# Altium project D00173332_IP3734.PRJPCB
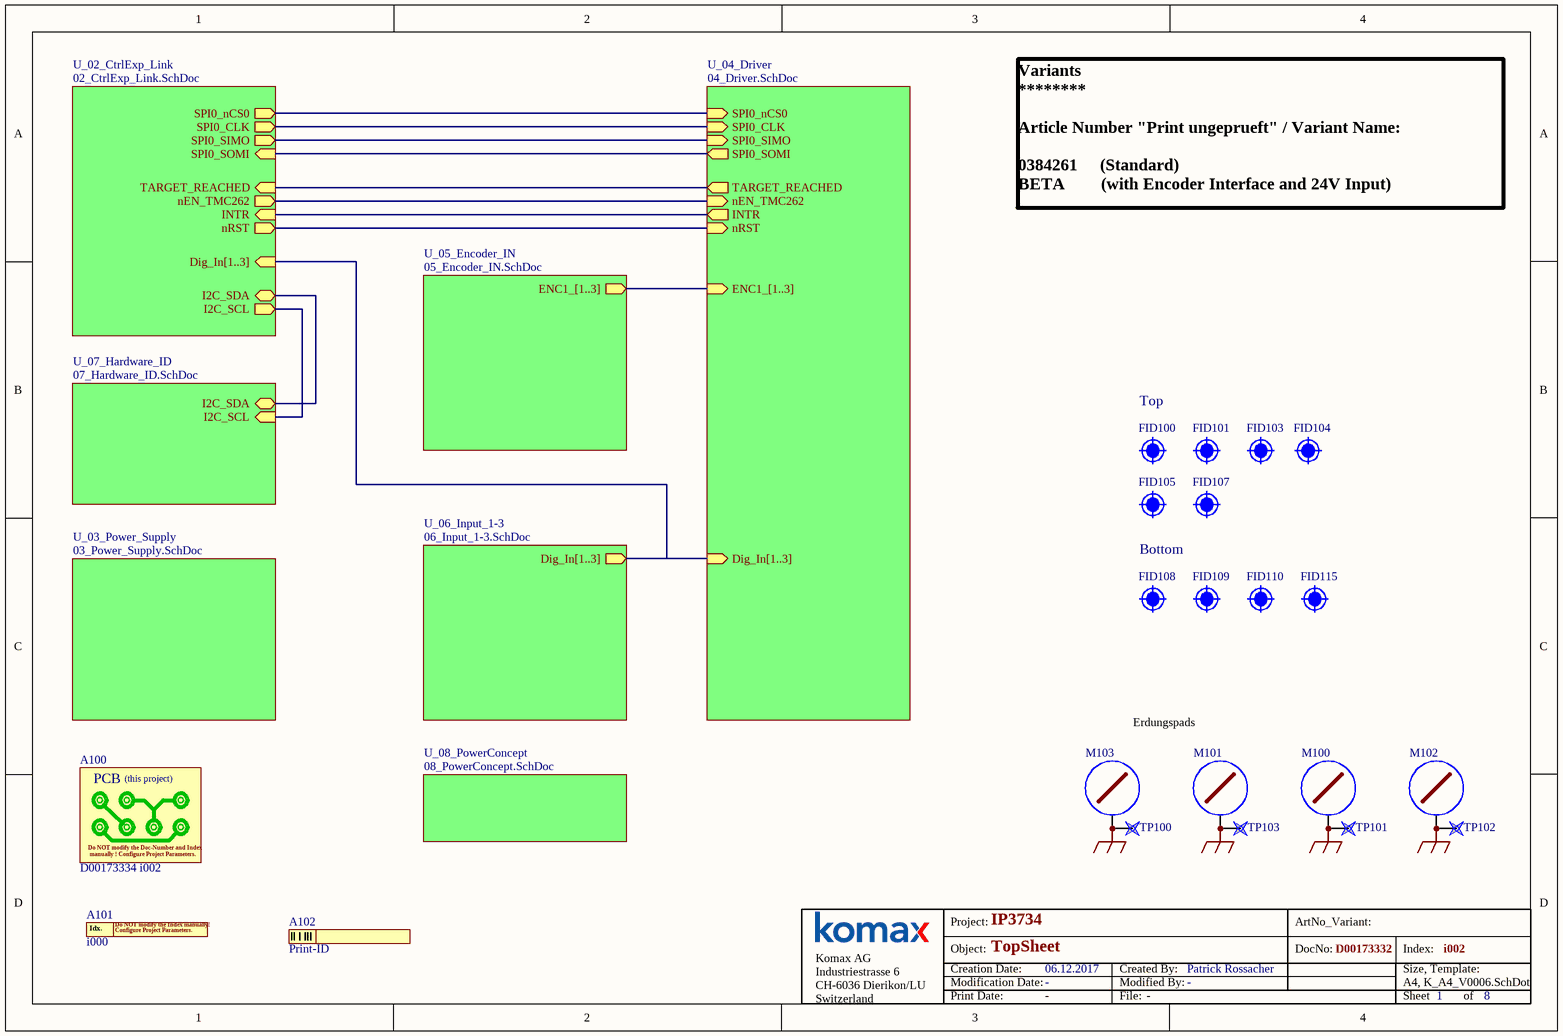
[diagram p0: 01_D00173332_TopSheet.SchDoc]
KPP_Assembly_DocNr: D00173333; KPP_Assembly_Variant_DocNr: Dyyyyyyyy; KPP_Idx: i002; KPP_Pcb_DocNr: D00173334; KPP_Pcb_Idx: i002; KPP_Proj_Name: IP3734; KPP_Proj_Sch_Bom_DocNr: D00173332; KPP_Proj_Vorlage: 0006 (do not edit); KSP_OutputFolder_AltiumProject: AltiumProject; KSP_OutputFolder_Assembly: AssemblyData; KSP_OutputFolder_Assembly_Variant: AssemblyDataVariant; KSP_OutputFolder_PCB: PCBData
8 sheets, 328 parts. Net scope: hierarchical (ports join the sheet entries above them; power ports are global).
Board file: D00173334_IP3734_pcb.pcbdoc
Sheets:
  01_D00173332_TopSheet.SchDoc
    U_02_CtrlExp_Link = 02_CtrlExp_Link.SchDoc
    U_03_Power_Supply = 03_Power_Supply.SchDoc
    U_04_Driver = 04_Driver.SchDoc
    U_05_Encoder_IN = 05_Encoder_IN.SchDoc
    U_06_Input_1-3 = 06_Input_1-3.SchDoc
    U_07_Hardware_ID = 07_Hardware_ID.SchDoc
    U_08_PowerConcept = 08_PowerConcept.SchDoc

## Sheet 01_D00173332_TopSheet.SchDoc: -
size A4; PageSetup: Record=PageOptions|CenterHorizontal=True|CenterVertical=True|PrintScale=0.97|XCorrection=1.00|YCorrection=1.00|PrintKind=1|BorderSize=5000000|LeftOffset=0|BottomOffset=0|Orientation=2|PaperLength=1000|PaperWidth=1000|Scale=100|PaperSource=7|PrintQuality=-4|MediaType=1|DitherType=10|PrintScaleMode=1|PaperKind=A4|PaperIndex=9; Date: -; ApprovedBy: -; CheckedBy: -; Author: -; CompanyName: -; DrawnBy: -; Engineer: -; Organization: Komax AG; Address1: -; Address2: -; Address3: -; Address4: -; DocumentNumber: -; Revision: -; SheetNumber: 1; SheetTotal: 8; KSDP_ObjectName: TopSheet; KSDP_CreationDate: 06.12.2017; KSDP_CreatedBy: Patrick Rossacher; KSDP_ModificationDate: -; KSDP_ModifiedBy: -; CurrentTime: -; CurrentDate: -; Time: -; DocumentFullPathAndName: -; DocumentName: -; ModifiedDate: -; ImagePath: -

### Parts
A100  D00173334 i002  (mechanical)
A101  i000  [PrintIndex]
A102  Print-ID  [PrintID]
FID100  Fiducial  [FID_1.1mm]  (value not drawn)  (no BOM)
FID101  Fiducial  [FID_1.1mm]  (value not drawn)  (no BOM)
FID103  Fiducial  [FID_1.1mm]  (value not drawn)  (no BOM)
FID104  Fiducial  [FID_1.1mm]  (value not drawn)  (no BOM)
FID105  Fiducial  [FID_1.1mm]  (value not drawn)  (no BOM)
FID107  Fiducial  [FID_1.1mm]  (value not drawn)  (no BOM)
FID108  Fiducial  [FID_1.1mm]  (value not drawn)  (no BOM)
FID109  Fiducial  [FID_1.1mm]  (value not drawn)  (no BOM)
FID110  Fiducial  [FID_1.1mm]  (value not drawn)  (no BOM)
FID115  Fiducial  [FID_1.1mm]  (value not drawn)  (no BOM)
M100  M4  [M4/4,5/PAD9]  (value not drawn)  (no BOM)
M101  M4  [M4/4,5/PAD9]  (value not drawn)  (no BOM)
M102  M4  [M4/4,5/PAD9]  (value not drawn)  (no BOM)
M103  M4  [M4/4,5/PAD9]  (value not drawn)  (no BOM)
TP100  Testpoint  [TP1.5MM]  (value not drawn)  (no BOM)
TP101  Testpoint  [TP1.5MM]  (value not drawn)  (no BOM)
TP102  Testpoint  [TP1.5MM]  (value not drawn)  (no BOM)
TP103  Testpoint  [TP1.5MM]  (value not drawn)  (no BOM)

### Sub-sheets
U_02_CtrlExp_Link = 02_CtrlExp_Link.SchDoc: I2C_SDA (bidir), I2C_SCL (out), SPI0_nCS0 (out), SPI0_CLK (out), SPI0_SIMO (out), SPI0_SOMI (in), nEN_TMC262 (out), TARGET_REACHED (in), INTR (in), nRST (out), Dig_In[1..3] (in)
U_03_Power_Supply = 03_Power_Supply.SchDoc: no entries
U_04_Driver = 04_Driver.SchDoc: Dig_In[1..3] (in), ENC1_[1..3] (in), SPI0_nCS0 (in), SPI0_CLK (in), SPI0_SIMO (in), SPI0_SOMI (out), nEN_TMC262 (in), TARGET_REACHED (out), INTR (out), nRST (in)
U_05_Encoder_IN = 05_Encoder_IN.SchDoc: ENC1_[1..3] (out)
U_06_Input_1-3 = 06_Input_1-3.SchDoc: Dig_In[1..3] (out)
U_07_Hardware_ID = 07_Hardware_ID.SchDoc: I2C_SDA (bidir), I2C_SCL (in)
U_08_PowerConcept = 08_PowerConcept.SchDoc: no entries

### Nets
SHIELD_1: M103.1 TP100.1
SHIELD_2: M101.1 TP103.1
SHIELD_3: M100.1 TP101.1
SHIELD_4: M102.1 TP102.1
I2C_SCL: sheet U_02_CtrlExp_Link/I2C_SCL, sheet U_07_Hardware_ID/I2C_SCL
I2C_SDA: sheet U_02_CtrlExp_Link/I2C_SDA, sheet U_07_Hardware_ID/I2C_SDA
INTR: sheet U_02_CtrlExp_Link/INTR, sheet U_04_Driver/INTR
nRST: sheet U_02_CtrlExp_Link/nRST, sheet U_04_Driver/nRST
SPI0_CLK: sheet U_02_CtrlExp_Link/SPI0_CLK, sheet U_04_Driver/SPI0_CLK
SPI0_nCS0: sheet U_02_CtrlExp_Link/SPI0_nCS0, sheet U_04_Driver/SPI0_nCS0
SPI0_SIMO: sheet U_02_CtrlExp_Link/SPI0_SIMO, sheet U_04_Driver/SPI0_SIMO
SPI0_SOMI: sheet U_02_CtrlExp_Link/SPI0_SOMI, sheet U_04_Driver/SPI0_SOMI
TARGET_REACHED: sheet U_02_CtrlExp_Link/TARGET_REACHED, sheet U_04_Driver/TARGET_REACHED
NetR401_1: sheet U_02_CtrlExp_Link/nEN_TMC262, sheet U_04_Driver/nEN_TMC262

### Buses and harness runs
bus sheet U_02_CtrlExp_Link/Dig_In[1..3] = sheet U_04_Driver/Dig_In[1..3] = sheet U_06_Input_1-3/Dig_In[1..3]
bus sheet U_04_Driver/ENC1_[1..3] = sheet U_05_Encoder_IN/ENC1_[1..3]

### Notes on the sheet
- Variants
  ********
  Article Number "Print ungeprueft" / Variant Name:
  0384261     (Standard)
  BETA        (with Encoder Interface and 24V Input)
- Top
- Bottom
- Erdungspads
- Project:
- ArtNo_Variant:
- Object:
- Creation Date:
- Modification Date:
- Created By:
- Modified By:
- DocNo:
- Index:
- Size, Template:
- A4, K_A4_V0006.SchDot
- Komax AG
  Industriestrasse 6
  CH-6036 Dierikon/LU
  Switzerland
- Print Date:
- File:
- Sheet
- of
- (in symbol Kleber Artikel-Index) Do NOT modify the Index manually!; Idx.; Configure Project Parameters.
- (in symbol PCB from project) PCB; (this project); Do NOT modify the Doc-Number and Index; manually ! Configure Project Parameters.

### Library data of the parts
A100 = PCB from project: PCB not assembled
A101 = Kleber Artikel-Index: Etiquette Article-Index; Notes: Positioning and design see assembly instructions
A102 = Kleber Printidentifikation: Etiquette PCB Identification; Notes: Positioning and design see assembly instructions
FID100 FID101 FID103-FID105 FID107-FID110 FID115 = FID: FootprintBOM: Fiducal 1.1mm; Notes: Fiducial
M100-M103 = PAD1: Bohrung mit PAD; Strategic: 0; Bezeichnung: M4
TP100-TP103 = P_PRUEFPAD: FootprintBOM: Testpoint

## Sheet 02_CtrlExp_Link.SchDoc: -
size A4; Date: -; ApprovedBy: -; CheckedBy: -; Author: -; CompanyName: -; DrawnBy: -; Engineer: -; Organization: Komax AG; Address1: -; Address2: -; Address3: -; Address4: -; DocumentNumber: -; Revision: -; SheetNumber: 2; SheetTotal: 8; KSDP_ObjectName: CtrlExp Link; KSDP_CreatedBy: Patrick Rossacher; KSDP_CreationDate: 20.12.2017; KSDP_ModificationDate: -; KSDP_ModifiedBy: -; CurrentTime: -; CurrentDate: -; Time: -; DocumentFullPathAndName: -; DocumentName: -; ModifiedDate: -; ImagePath: -
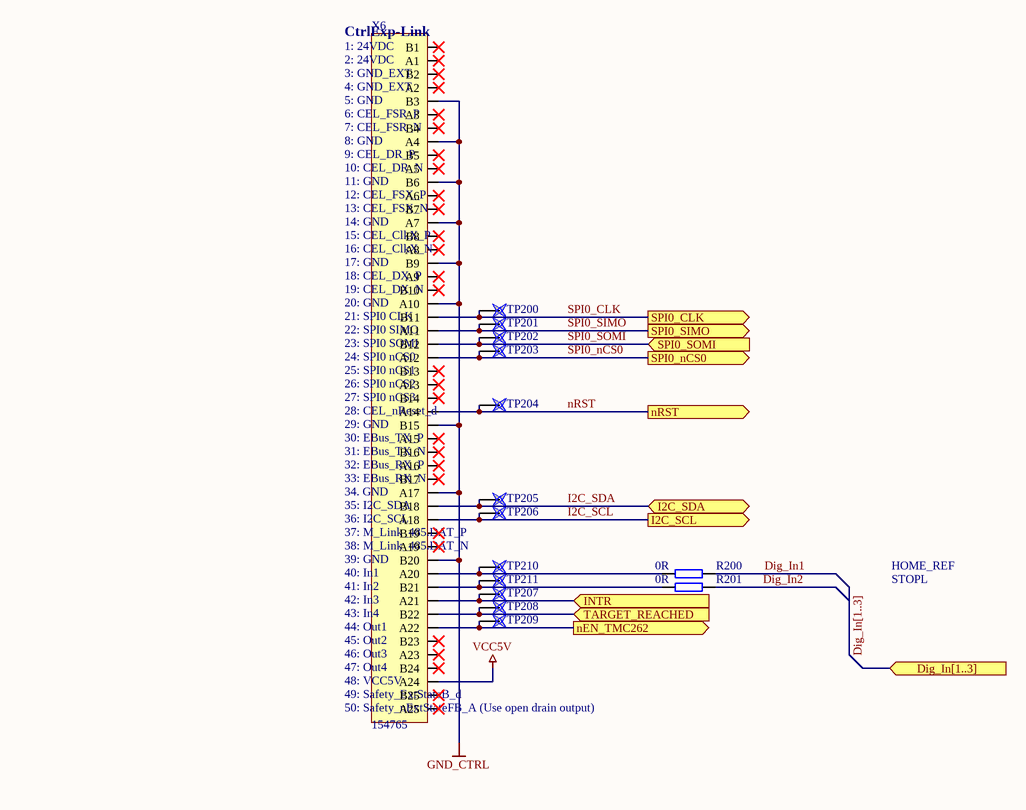
[diagram p1: 02_CtrlExp_Link.SchDoc]

### Parts
(Parts that share a designator on the sheet are numbered #1, #2 ... from top to bottom, then left to right.)
R200  0R  [0402_R]
R201  0R  [0402_R]
TP200  Testpoint  [TP1.5MM]  (value not drawn)  (no BOM)
TP201  Testpoint  [TP1.5MM]  (value not drawn)  (no BOM)
TP202  Testpoint  [TP1.5MM]  (value not drawn)  (no BOM)
TP203  Testpoint  [TP1.5MM]  (value not drawn)  (no BOM)
TP204  Testpoint  [TP1.5MM]  (value not drawn)  (no BOM)
TP205  Testpoint  [TP1.5MM]  (value not drawn)  (no BOM)
TP206  Testpoint  [TP1.5MM]  (value not drawn)  (no BOM)
TP207  Testpoint  [TP1.5MM]  (value not drawn)  (no BOM)
TP208  Testpoint  [TP1.5MM]  (value not drawn)  (no BOM)
TP209  Testpoint  [TP1.5MM]  (value not drawn)  (no BOM)
TP210  Testpoint  [TP1.5MM]  (value not drawn)  (no BOM)
TP211  Testpoint  [TP1.5MM]  (value not drawn)  (no BOM)
X6#1  154765  [CON_SMD_50P_ERNI_154765]

### Ports
Dig_In[1..3] (in), I2C_SCL (out), I2C_SDA (bidir), INTR (in), nEN_TMC262 (out), nRST (out), SPI0_CLK (out), SPI0_nCS0 (out), SPI0_SIMO (out), SPI0_SOMI (in), TARGET_REACHED (in)

### Nets
GND_CTRL: X6#1.A4 X6#1.A7 X6#1.A10 X6#1.A17 X6#1.B3 X6#1.B6 X6#1.B9 X6#1.B15 X6#1.B20
VCC5V: X6#1.A24
Dig_In1: R200.2
Dig_In2: R201.2
I2C_SCL: TP206.1 X6#1.A18 ; port I2C_SCL
I2C_SDA: TP205.1 X6#1.B18 ; port I2C_SDA
INTR: TP207.1 X6#1.A21 ; port INTR
nRST: TP204.1 X6#1.A14 ; port nRST
SPI0_CLK: TP200.1 X6#1.B11 ; port SPI0_CLK
SPI0_nCS0: TP203.1 X6#1.A12 ; port SPI0_nCS0
SPI0_SIMO: TP201.1 X6#1.A11 ; port SPI0_SIMO
SPI0_SOMI: TP202.1 X6#1.B12 ; port SPI0_SOMI
TARGET_REACHED: TP208.1 X6#1.B22 ; port TARGET_REACHED
NetR200_1: R200.1 TP210.1 X6#1.A20
NetR201_1: R201.1 TP211.1 X6#1.B21
NetR401_1: TP209.1 X6#1.A22 ; port nEN_TMC262

Not connected (* = marked no-connect by the designer): X6#1 A1* A2* A3* A5* A6* A8* A9* A13* A15* A16* A19* A23* A25* B1* B2* B4* B5* B7* B8* B10* B13* B14* B16* B17* B19* B23* B24* B25*

### Buses and harness runs
bus Dig_In[1..3] = port Dig_In[1..3]

### Notes on the sheet
- CtrlExp-Link
- 5: GND
- 1: 24VDC
- 2: 24VDC
- 6: CEL_FSR_P
- 3: GND_EXT
- 4: GND_EXT
- 7: CEL_FSR_N
- 8: GND
- 9: CEL_DR_P
- 10: CEL_DR_N
- 11: GND
- 12: CEL_FSX_P
- 13: CEL_FSX_N
- 14: GND
- 15: CEL_ClkX_P
- 16: CEL_ClkX_N
- 17: GND
- 18: CEL_DX_P
- 19: CEL_DX_N
- 20: GND
- 21: SPI0 CLK
- 22: SPI0 SIMO
- 23: SPI0 SOMI
- 24: SPI0 nCS0
- 25: SPI0 nCS1
- 26: SPI0 nCS2
- 27: SPI0 nCS3
- 29: GND
- 30: EBus_TX_P
- 28: CEL_nReset_d
- 34. GND
- 31: EBus_TX_N
- 32: EBus_RX_P
- 33: EBus_RX_N
- 35: I2C_SDA
- 36: I2C_SCL
- 39: GND
- 37: M_Link_485.DAT_P
- 40: In1
- 38: M_Link_485.DAT_N
- STOPL
- HOME_REF
- 41: In2
- 42: In3
- 43: In4
- 44: Out1
- 45: Out2
- 46: Out3
- 48: VCC5V
- 49: Safety_ExtStateB_d
- 50: Safety_nExtStateFB_A (Use open drain output)
- 47: Out4
- Project:
- ArtNo_Variant:
- Object:
- Creation Date:
- Modification Date:
- Created By:
- Modified By:
- DocNo:
- Index:
- Size, Template:
- A4, K_A4_V0006.SchDot
- Komax AG
  Industriestrasse 6
  CH-6036 Dierikon/LU
  Switzerland
- Print Date:
- File:
- Sheet
- of

### Library data of the parts
R200 R201 = RES2: Resistor 0.063W 1%; FootprintBOM: 0402
TP200-TP211 = P_PRUEFPAD: FootprintBOM: Testpoint
X6#1 = CON_50P_ERNI: Connector SMC 2x25p 90° 1.27mm; Manufacturer: ERNI; MaxTemp: 125; MinTemp: -55; 2ndSource: 15 15 050 5601 333 / Harting; 3rdSource: *; Bemerkung: 90°; Distributor: *; FootprintBOM: SMD RM=1.27mm; Notes: *; Reference: *; Strategic: *

## Sheet 03_Power_Supply.SchDoc: -
size A4; Date: -; ApprovedBy: -; CheckedBy: -; Author: -; CompanyName: -; DrawnBy: -; Engineer: -; Organization: Komax AG; Address1: -; Address2: -; Address3: -; Address4: -; DocumentNumber: -; Revision: -; SheetNumber: 3; SheetTotal: 8; KSDP_ObjectName: Power Supply; KSDP_CreatedBy: Patrick Rossacher; KSDP_CreationDate: 15.12.2017; KSDP_ModificationDate: -; KSDP_ModifiedBy: -; CurrentTime: -; CurrentDate: -; Time: -; DocumentFullPathAndName: -; DocumentName: -; ModifiedDate: -; ImagePath: -
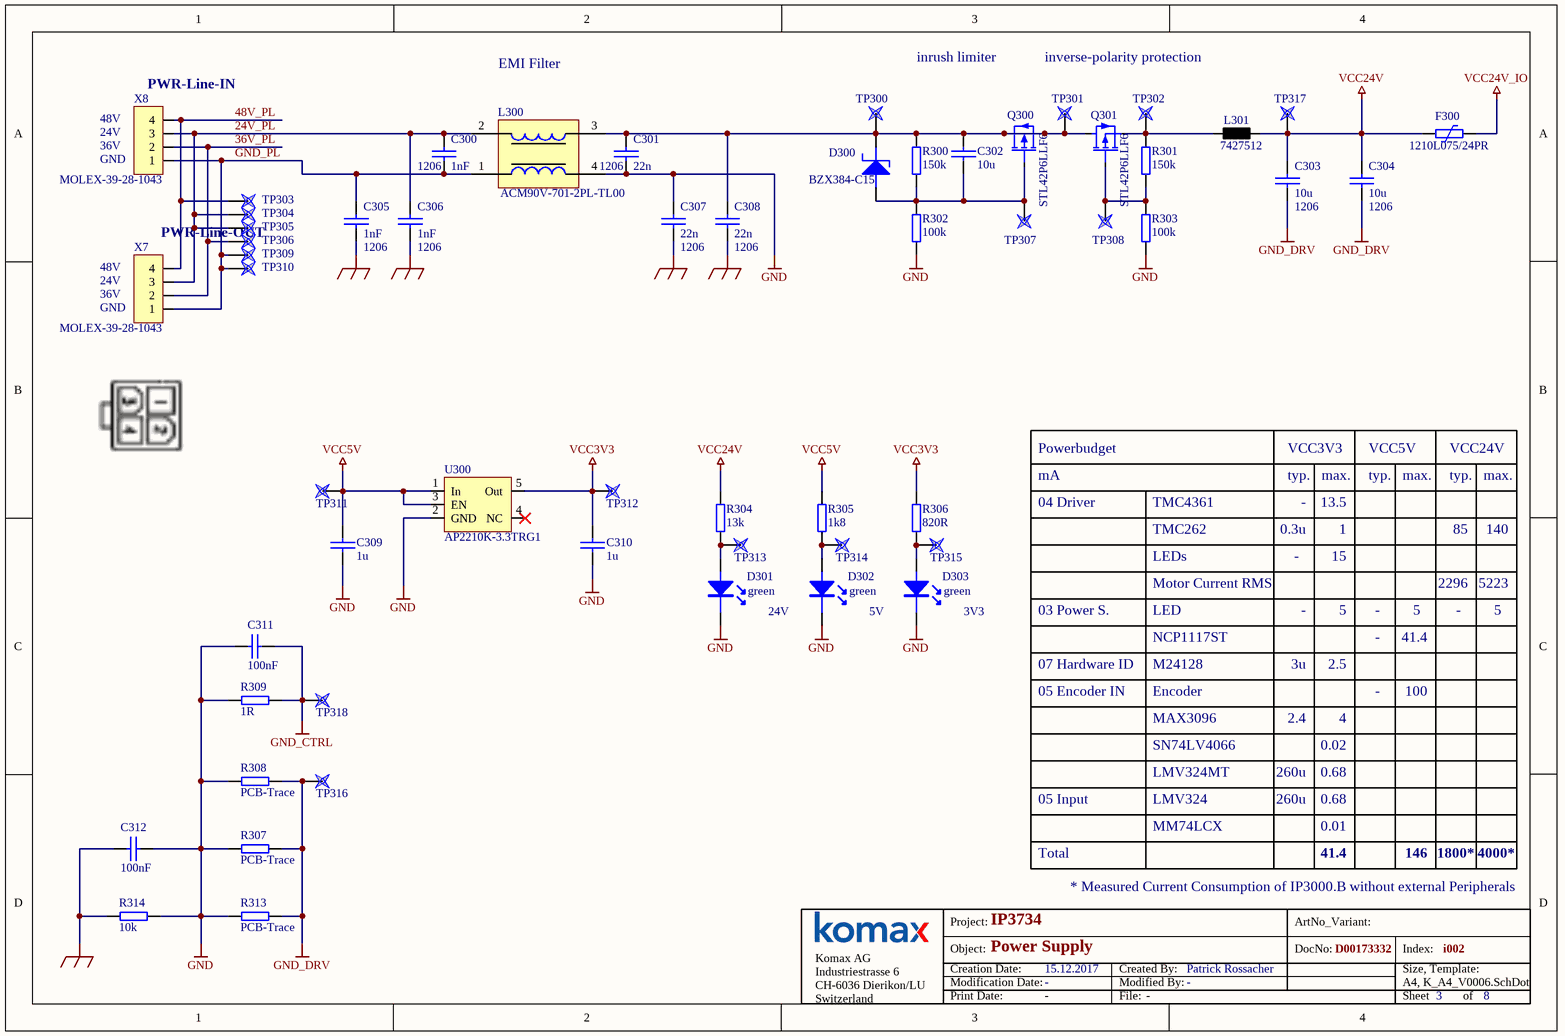
[diagram p2: 03_Power_Supply.SchDoc]

### Parts
(Parts that share a designator on the sheet are numbered #1, #2 ... from top to bottom, then left to right.)
C300  1nF  FootprintBOM: 1206  [1206_C]
C301  22n  FootprintBOM: 1206  [1206_C]
C302  10u  [1206_C]
C303  10u  FootprintBOM: 1206  [1206_C]
C304  10u  FootprintBOM: 1206  [1206_C]
C305  1nF  FootprintBOM: 1206  [1206_C]
C306  1nF  FootprintBOM: 1206  [1206_C]
C307  22n  FootprintBOM: 1206  [1206_C]
C308  22n  FootprintBOM: 1206  [1206_C]
C309  1u  [0805_C]
C310  1u  [0805_C]
C311  100nF  [0805_C]
C312  100nF  [0805_C]
D300  BZX384-C15  [SOD-323]
D301  color: green  [0603_led]  (hidden comment: HSMG-C190)
D302  color: green  [0603_led]  (hidden comment: HSMG-C190)
D303  color: green  [0603_led]  (hidden comment: HSMG-C190)
F300  1210L075/24PR  [1210_L]
L300  ACM90V-701-2PL-TL00  [ACM90V]
L301  7427512  [7427512]
Q300  STL42P6LLF6  [PQFN-8_Multi]
Q301  STL42P6LLF6  [PQFN-8_Multi]
R300  150k  [0402_R]
R301  150k  [0402_R]
R302  100k  [0402_R]
R303  100k  [0402_R]
R304  13k  [1206_R]
R305  1k8  [0402_R]
R306  820R  [0402_R]
R307  PCB-Trace  [NET-CONNECT6]  (net tie, no BOM)
R308  PCB-Trace  [NET-CONNECT6]  (net tie, no BOM)
R309  1R  [0805_R]
R313  PCB-Trace  [NET-CONNECT6]  (net tie, no BOM)
R314  10k  [0805_R]
TP300  Testpoint  [TP1.5MM]  (value not drawn)  (no BOM)
TP301  Testpoint  [TP1.5MM]  (value not drawn)  (no BOM)
TP302  Testpoint  [TP1.5MM]  (value not drawn)  (no BOM)
TP303  Testpoint  [TP1.5MM]  (value not drawn)  (no BOM)
TP304  Testpoint  [TP1.5MM]  (value not drawn)  (no BOM)
TP305  Testpoint  [TP1.5MM]  (value not drawn)  (no BOM)
TP306  Testpoint  [TP1.5MM]  (value not drawn)  (no BOM)
TP307  Testpoint  [TP1.5MM]  (value not drawn)  (no BOM)
TP308  Testpoint  [TP1.5MM]  (value not drawn)  (no BOM)
TP309  Testpoint  [TP1.5MM]  (value not drawn)  (no BOM)
TP310  Testpoint  [TP1.5MM]  (value not drawn)  (no BOM)
TP311  Testpoint  [TP1.5MM]  (value not drawn)  (no BOM)
TP312  Testpoint  [TP1.5MM]  (value not drawn)  (no BOM)
TP313  Testpoint  [TP1.5MM]  (value not drawn)  (no BOM)
TP314  Testpoint  [TP1.5MM]  (value not drawn)  (no BOM)
TP315  Testpoint  [TP1.5MM]  (value not drawn)  (no BOM)
TP316  Testpoint  [TP1.5MM]  (value not drawn)  (no BOM)
TP317  Testpoint  [TP1.5MM]  (value not drawn)  (no BOM)
TP318  Testpoint  [TP1.5MM]  (value not drawn)  (no BOM)
U300  AP2210K-3.3TRG1  [SOT23-5]
X7#1  MOLEX-39-28-1043  [MOLEX-Minifit_4P_90_180deg]
X8#1  MOLEX-39-28-1043  [MOLEX-Minifit_4P_90_180deg]

### Nets
GND: C301.1 C307.2 C309.2 C310.2 C311.2 C312.1 D301.K D302.K D303.K L300.4 R302.1 R303.1 R307.2 R308.2 R309.2 R313.2 R314.1 U300.2(GND)
GND_CTRL: C311.1 R309.1 TP318.1
GND_DRV: C303.1 C304.1 R307.1 R308.1 R313.1 TP316.1
SHIELD_3: C305.1 C306.1 C307.1 C308.1 C312.2 R314.2
VCC3V3: C310.1 R306.2 TP312.1 U300.5(Out)
VCC5V: C309.1 R305.2 TP311.1 U300.1(In) U300.3(EN)
VCC24V: C303.2 C304.2 F300.1 L301.2 R304.2 TP317.1
VCC24V_IO: F300.2
24V_PL: C300.2 C306.2 L300.2 TP304.1 TP305.1 X7#1.3 X8#1.3
36V_PL: TP306.1 X7#1.2 X8#1.2
48V_PL: TP303.1 X7#1.4 X8#1.4
GND_PL: C300.1 C305.2 L300.1 TP309.1 TP310.1 X7#1.1 X8#1.1
NetC301_2: C301.2 C302.1 C308.2 D300.K L300.3 Q300.D Q300.S Q301.D R300.2 TP300.1 TP301.1
NetC302_2: C302.2 D300.A Q300.G R300.1 R302.2 TP307.1
NetD301_A: D301.A R304.1 TP313.1
NetD302_A: D302.A R305.1 TP314.1
NetD303_A: D303.A R306.1 TP315.1
NetL301_1: L301.1 Q301.S R301.2 TP302.1
NetQ301_G: Q301.G R301.1 R303.2 TP308.1

Not connected (* = marked no-connect by the designer): U300 4(NC)*

### Notes on the sheet
- (near X8#1) PWR-Line-IN
- EMI Filter
- inrush limiter
- inverse-polarity protection
- (near X8#1) GND
- (near X8#1) 36V
- (near X8#1) 24V
- (near X8#1) 48V
- (near X7#1) PWR-Line-OUT
- (near X7#1) GND
- (near X7#1) 36V
- (near X7#1) 24V
- (near X7#1) 48V
- Powerbudget
- 04 Driver
- mA
- TMC4361
- VCC3V3
- typ.
- -
- max.
- 13.5
- VCC5V
- VCC24V
- TMC262
- LEDs
- 0.3u
- 1
- 15
- 85
- 140
- (near D301) 24V
- 5V
- (near D303) 3V3
- 03 Power S.
- Motor Current RMS
- NCP1117ST
- LED
- 5
- 41.4
- 2296
- 5223
- 07 Hardware ID
- 05 Encoder IN
- M24128
- Encoder
- 3u
- 2.5
- 100
- MAX3096
- SN74LV4066
- LMV324MT
- 2.4
- 260u
- 4
- 0.02
- 0.68
- 05 Input
- MM74LCX
- LMV324
- 0.01
- Total
- 146
- 1800*
- 4000*
- * Measured Current Consumption of IP3000.B without external Peripherals
- Project:
- ArtNo_Variant:
- Object:
- Creation Date:
- Modification Date:
- Created By:
- Modified By:
- DocNo:
- Index:
- Size, Template:
- A4, K_A4_V0006.SchDot
- Komax AG
  Industriestrasse 6
  CH-6036 Dierikon/LU
  Switzerland
- Print Date:
- File:
- Sheet
- of

### Library data of the parts
C300-C308 = CAP: Ceramic Capacitor >=50V X7R
  C302: FootprintBOM: 1206
C309 C310 = CAP: Ceramic Capacitor >=25V; FootprintBOM: 0805
C311 C312 = Cap: Ceramic Capacitor >=50V X7R; FootprintBOM: 0805
D300 = DIODEZENER: ZenerDiode 15V; Manufacturer: NXP; MaxTemp: Tj +150; MinTemp: -55; FootprintBOM: SOD-323
D301-D303 = LED: SMD LED green; Manufacturer: AVAGO; Forward Voltage: 2.2V
F300 = THERMAL FUSE_1: Polyfuse 750mA; Manufacturer: Littlefuse; MaxTemp: +85; MinTemp: -40; FootprintBOM: 1210
L300 = ACM1211-701-2PL-TL01: Common Mode Chokes Dual 700Ohm 100MHz 5A 10mOhm DCR SMD T/R; Manufacturer: TDK; FootprintBOM: ACM90V
L301 = Power_Choke: Ferrit Bead 580Ohm @ 100MHz / 5A; Manufacturer: Würth
Q300 Q301 = MOSFET-P 1G,2x,3S,4D (Diode): P-Channel Power MOSFET, -60V; 3rdSource: FDMS86163P; MaxTemp: 175; MinTemp: -50; Rdson: 26m; 2ndSourcesReleased: DMP6050SPS-13; Bemerkung: *; Distributor: *; FootprintBOM: *; Manufacturer: *; Notes: *; Reference: *; Strategic: *
R300-R303 R305 R306 = RES2: Resistor 0.063W 1%; FootprintBOM: 0402
R304 = RES2: Resistor 0.25W 1%; FootprintBOM: 1206
R307 R308 R313 = RES2: Circuit Path; FootprintBOM: -
R309 R314 = RES2: Resistor 0.125W 1%; FootprintBOM: 0805
TP300-TP318 = P_PRUEFPAD: FootprintBOM: Testpoint
U300 = Linear_Regulator: Linear Voltage Regulator; Manufacturer: Diodes Incorporated; 3rdSource: SPX3819M5-L-3-3/TR; 2ndSourcesReleased: LD2980CM33TR; FootprintBOM: SOT-23-5
X7#1 X8#1 = CON_4P: Connector Mini Fit 4p 180°; Manufacturer: Molex; FootprintBOM: THT

## Sheet 04_Driver.SchDoc: -
size A3; Date: -; ApprovedBy: -; CheckedBy: -; Author: -; CompanyName: -; DrawnBy: -; Engineer: -; Organization: Komax AG; Address1: -; Address2: -; Address3: -; Address4: -; DocumentNumber: -; Revision: -; SheetNumber: 4; SheetTotal: 8; KSDP_ObjectName: Driver; KSDP_CreatedBy: Patrick Rossacher; KSDP_CreationDate: 15.12.2017; KSDP_ModificationDate: -; KSDP_ModifiedBy: -; CurrentTime: -; CurrentDate: -; Time: -; DocumentFullPathAndName: -; DocumentName: -; ModifiedDate: -; ImagePath: -
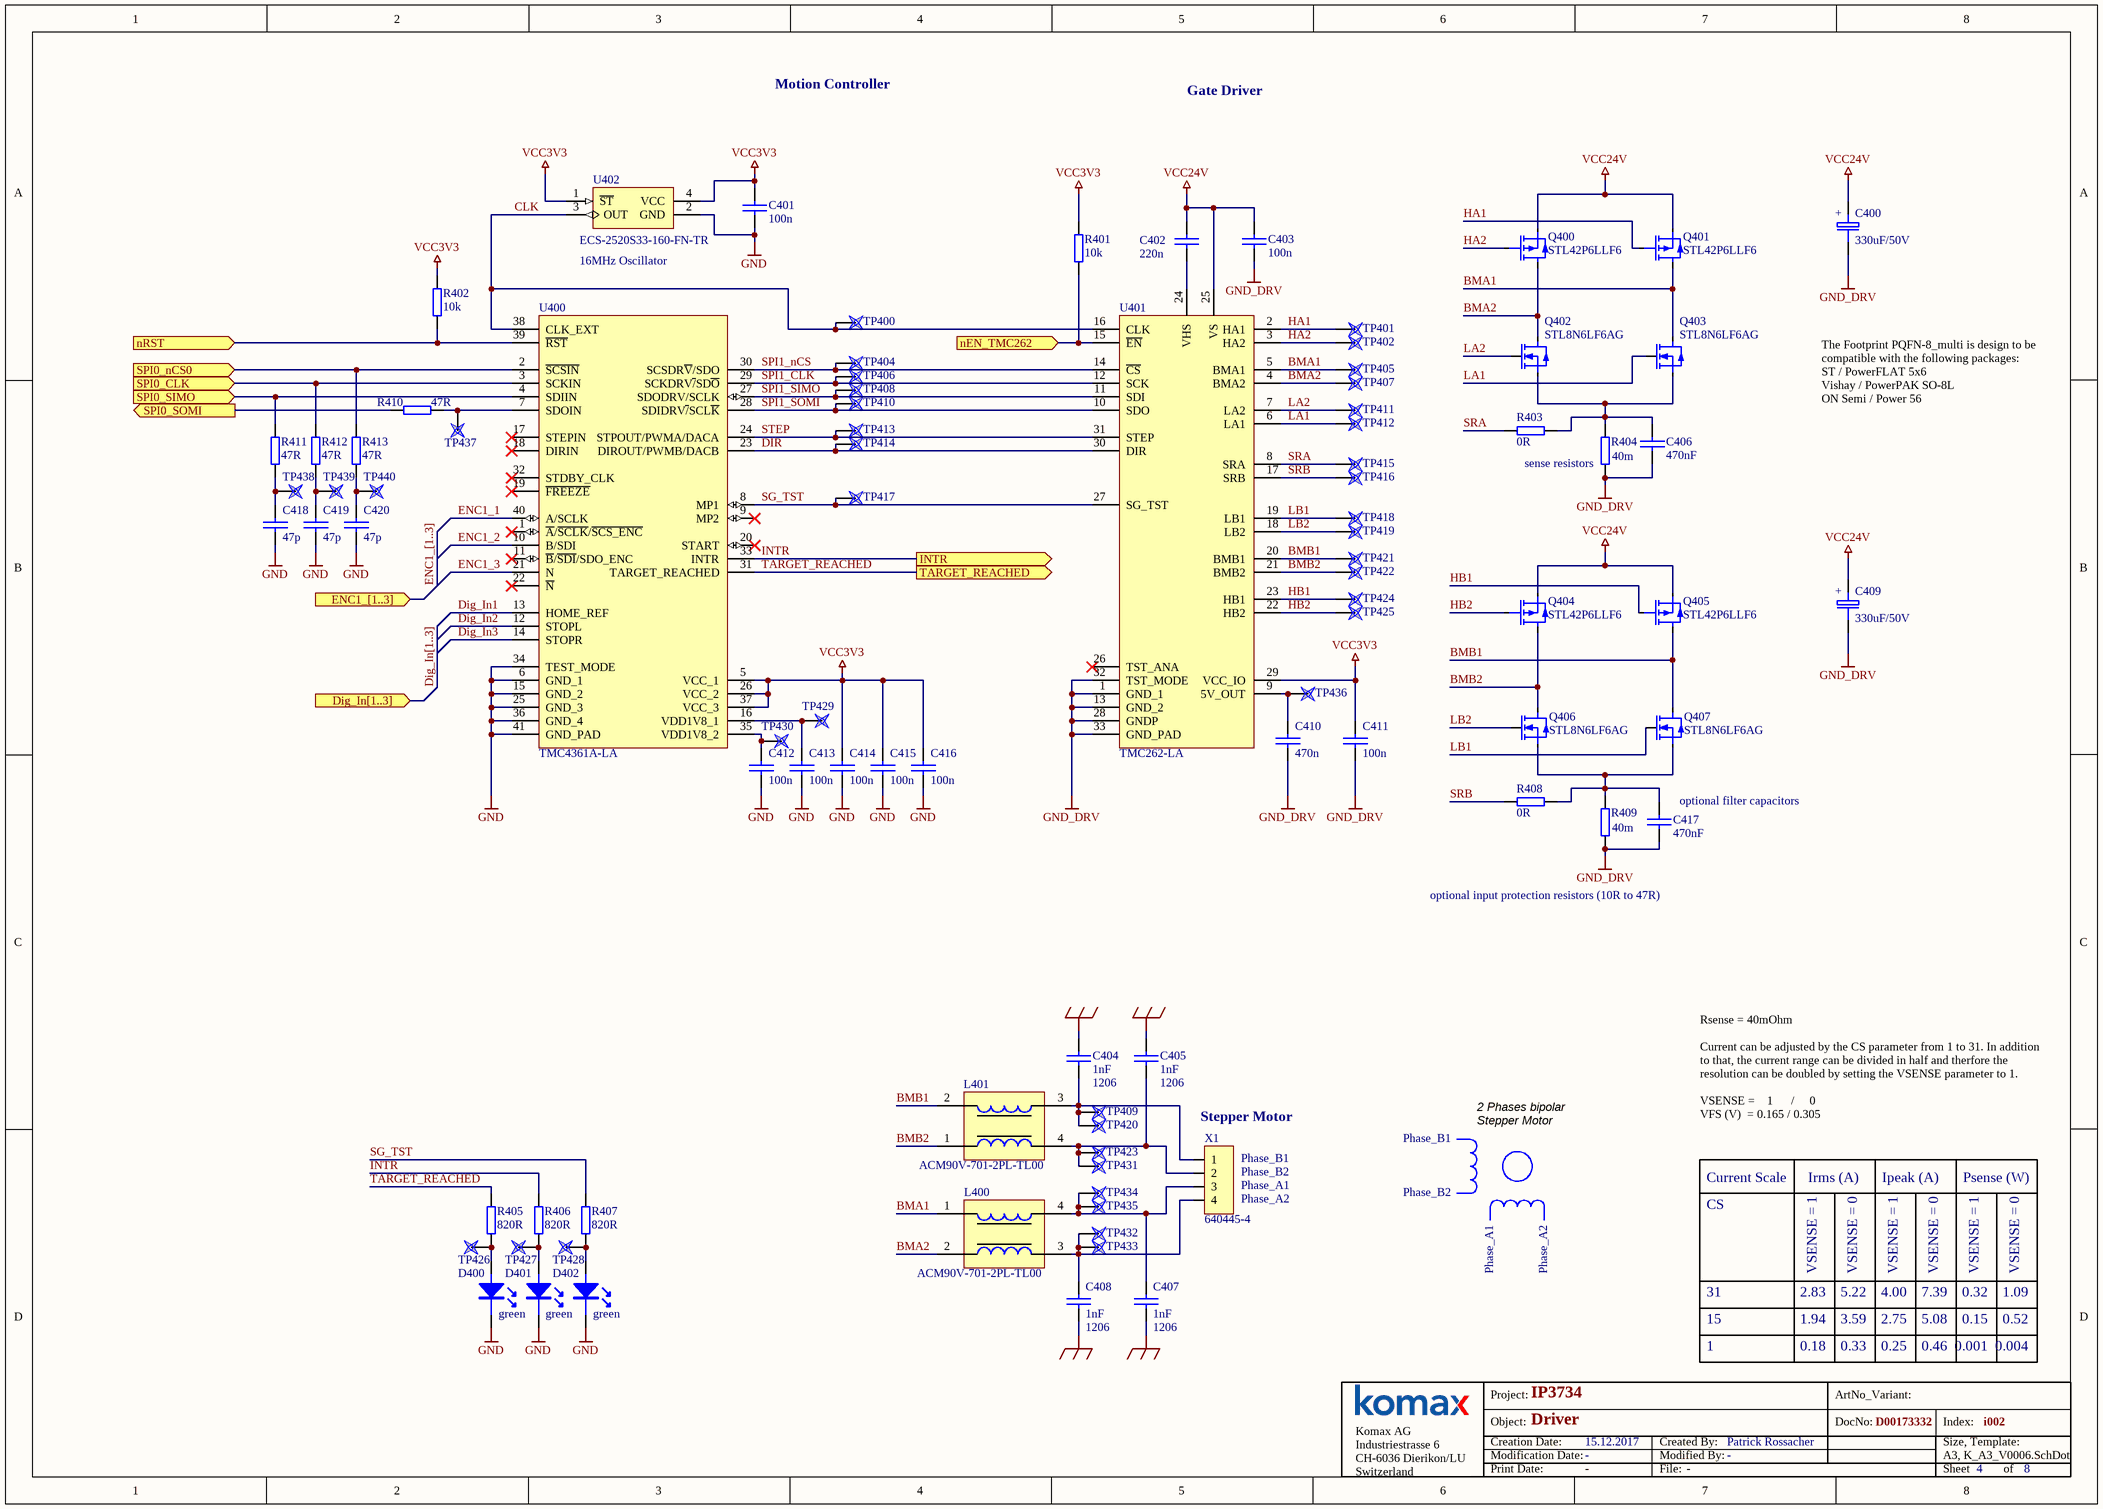
[diagram p3: 04_Driver.SchDoc]

### Parts
(Parts that share a designator on the sheet are numbered #1, #2 ... from top to bottom, then left to right.)
C400  330uF/50V  [SMD_Cap_Panasonic_H13]
C401  100n  [0402_C]
C402  220n  [0603_C]
C403  100n  [0402_C]
C404  1nF  FootprintBOM: 1206  [1206_C]
C405  1nF  FootprintBOM: 1206  [1206_C]
C406  470nF  [0603_C]
C407  1nF  FootprintBOM: 1206  [1206_C]
C408  1nF  FootprintBOM: 1206  [1206_C]
C409  330uF/50V  [SMD_Cap_Panasonic_H13]
C410  470n  [0603_C]
C411  100n  [0402_C]
C412  100n  [0402_C]
C413  100n  [0402_C]
C414  100n  [0402_C]
C415  100n  [0402_C]
C416  100n  [0402_C]
C417  470nF  [0603_C]
C418  47p  [0402_C]
C419  47p  [0402_C]
C420  47p  [0402_C]
D400  color: green  [0603_led]  (hidden comment: HSMG-C190)
D401  color: green  [0603_led]  (hidden comment: HSMG-C190)
D402  color: green  [0603_led]  (hidden comment: HSMG-C190)
L400  ACM90V-701-2PL-TL00  [ACM90V]
L401  ACM90V-701-2PL-TL00  [ACM90V]
Q400  STL42P6LLF6  [PQFN-8_Multi]
Q401  STL42P6LLF6  [PQFN-8_Multi]
Q402  STL8N6LF6AG  [PQFN-8_Multi]
Q403  STL8N6LF6AG  [PQFN-8_Multi]
Q404  STL42P6LLF6  [PQFN-8_Multi]
Q405  STL42P6LLF6  [PQFN-8_Multi]
Q406  STL8N6LF6AG  [PQFN-8_Multi]
Q407  STL8N6LF6AG  [PQFN-8_Multi]
R401  10k  [0402_R]
R402  10k  [0402_R]
R403  0R  [0402_R]
R404  value 40m  [2512_R]  (hidden comment: CRA2512-FZ-R040ELF)
R405  820R  [0402_R]
R406  820R  [0402_R]
R407  820R  [0402_R]
R408  0R  [0402_R]
R409  value 40m  [2512_R]  (hidden comment: CRA2512-FZ-R040ELF)
R410  47R  [0402_R]
R411  47R  [0402_R]
R412  47R  [0402_R]
R413  47R  [0402_R]
TP400  Testpoint  [TP1.5MM]  (value not drawn)  (no BOM)
TP401  Testpoint  [TP1.5MM]  (value not drawn)  (no BOM)
TP402  Testpoint  [TP1.5MM]  (value not drawn)  (no BOM)
TP404  Testpoint  [TP1.5MM]  (value not drawn)  (no BOM)
TP405  Testpoint  [TP1.5MM]  (value not drawn)  (no BOM)
TP406  Testpoint  [TP1.5MM]  (value not drawn)  (no BOM)
TP407  Testpoint  [TP1.5MM]  (value not drawn)  (no BOM)
TP408  Testpoint  [TP1.5MM]  (value not drawn)  (no BOM)
TP409  Testpoint  [TP1.5MM]  (value not drawn)  (no BOM)
TP410  Testpoint  [TP1.5MM]  (value not drawn)  (no BOM)
TP411  Testpoint  [TP1.5MM]  (value not drawn)  (no BOM)
TP412  Testpoint  [TP1.5MM]  (value not drawn)  (no BOM)
TP413  Testpoint  [TP1.5MM]  (value not drawn)  (no BOM)
TP414  Testpoint  [TP1.5MM]  (value not drawn)  (no BOM)
TP415  Testpoint  [TP1.5MM]  (value not drawn)  (no BOM)
TP416  Testpoint  [TP1.5MM]  (value not drawn)  (no BOM)
TP417  Testpoint  [TP1.5MM]  (value not drawn)  (no BOM)
TP418  Testpoint  [TP1.5MM]  (value not drawn)  (no BOM)
TP419  Testpoint  [TP1.5MM]  (value not drawn)  (no BOM)
TP420  Testpoint  [TP1.5MM]  (value not drawn)  (no BOM)
TP421  Testpoint  [TP1.5MM]  (value not drawn)  (no BOM)
TP422  Testpoint  [TP1.5MM]  (value not drawn)  (no BOM)
TP423  Testpoint  [TP1.5MM]  (value not drawn)  (no BOM)
TP424  Testpoint  [TP1.5MM]  (value not drawn)  (no BOM)
TP425  Testpoint  [TP1.5MM]  (value not drawn)  (no BOM)
TP426  Testpoint  [TP1.5MM]  (value not drawn)  (no BOM)
TP427  Testpoint  [TP1.5MM]  (value not drawn)  (no BOM)
TP428  Testpoint  [TP1.5MM]  (value not drawn)  (no BOM)
TP429  Testpoint  [TP1.5MM]  (value not drawn)  (no BOM)
TP430  Testpoint  [TP1.5MM]  (value not drawn)  (no BOM)
TP431  Testpoint  [TP1.5MM]  (value not drawn)  (no BOM)
TP432  Testpoint  [TP1.5MM]  (value not drawn)  (no BOM)
TP433  Testpoint  [TP1.5MM]  (value not drawn)  (no BOM)
TP434  Testpoint  [TP1.5MM]  (value not drawn)  (no BOM)
TP435  Testpoint  [TP1.5MM]  (value not drawn)  (no BOM)
TP436  Testpoint  [TP1.5MM]  (value not drawn)  (no BOM)
TP437  Testpoint  [TP1.5MM]  (value not drawn)  (no BOM)
TP438  Testpoint  [TP1.5MM]  (value not drawn)  (no BOM)
TP439  Testpoint  [TP1.5MM]  (value not drawn)  (no BOM)
TP440  Testpoint  [TP1.5MM]  (value not drawn)  (no BOM)
U400  TMC4361A-LA  [TMC_QFN40_0.5_6.0X6.0]
U401  TMC262-LA  [TMC_QFN32_0.5_5.0X5.0]
U402  ECS-2520S33-160-FN-TR  [SMD_LPO_2.5x2mm]
X1#1  640445-4  [CON_THT_4P_MTA-156]

### Ports
Dig_In[1..3] (in), ENC1_[1..3] (in), INTR (out), nEN_TMC262 (in), nRST (in), SPI0_CLK (in), SPI0_nCS0 (in), SPI0_SIMO (in), SPI0_SOMI (out), TARGET_REACHED (out)

### Nets
GND: C401.2 C412.1 C413.1 C414.1 C415.1 C416.1 C418.1 C419.1 C420.1 D400.K D401.K D402.K U400.6(GND_1) U400.15(GND_2) U400.25(GND_3) U400.34(TEST_MODE) U400.36(GND_4) U400.41(GND_PAD) U402.2(GND)
GND_DRV: C400.2 C403.1 C406.2 C409.2 C410.1 C411.1 C417.1 R404.1 R409.2 U401.1(GND_1) U401.13(GND_2) U401.28(GNDP) U401.32(TST_MODE) U401.33(GND_PAD)
SHIELD_1: C407.1 C408.1
SHIELD_4: C404.1 C405.1
VCC3V3: C401.1 C411.2 C414.2 C415.2 C416.2 R401.2 R402.2 U400.5(VCC_1) U400.26(VCC_2) U400.37(VCC_3) U401.29(VCC_IO) U402.1(~{ST}) U402.4(VCC)
VCC24V: C400.1 C402.2 C403.2 C409.1 Q400.S Q401.S Q404.S Q405.S U401.25(VS)
BMA1: L400.1 Q401.D Q403.D TP405.1 U401.5(BMA1)
BMA2: L400.2 Q400.D Q402.D TP407.1 U401.4(BMA2)
BMB1: L401.2 Q405.D Q407.D TP421.1 U401.20(BMB1)
BMB2: L401.1 Q404.D Q406.D TP422.1 U401.21(BMB2)
CLK: TP400.1 U400.38(CLK_EXT) U401.16(CLK) U402.3(OUT)
Dig_In1: U400.13(HOME_REF)
Dig_In2: U400.12(STOPL)
Dig_In3: U400.14(STOPR)
DIR: TP414.1 U400.23(DIROUT/PWMB/DACB) U401.30(DIR)
ENC1_1: U400.40(A/SCLK)
ENC1_2: U400.10(B/SDI)
ENC1_3: U400.21(N)
HA1: Q401.G TP401.1 U401.2(HA1)
HA2: Q400.G TP402.1 U401.3(HA2)
HB1: Q405.G TP424.1 U401.23(HB1)
HB2: Q404.G TP425.1 U401.22(HB2)
INTR: R406.2 U400.33(INTR) ; port INTR
LA1: Q403.G TP412.1 U401.6(LA1)
LA2: Q402.G TP411.1 U401.7(LA2)
LB1: Q407.G TP418.1 U401.19(LB1)
LB2: Q406.G TP419.1 U401.18(LB2)
nRST: R402.1 U400.39(~{RST}) ; port nRST
SG_TST: R407.2 TP417.1 U400.8(MP1) U401.27(SG_TST)
SPI0_CLK: R412.2 U400.3(SCKIN) ; port SPI0_CLK
SPI0_nCS0: R413.2 U400.2(~{SCSIN}) ; port SPI0_nCS0
SPI0_SIMO: R411.2 U400.4(SDIIN) ; port SPI0_SIMO
SPI0_SOMI: R410.2 ; port SPI0_SOMI
SPI1_CLK: TP406.1 U400.29(SCKDRV~{/}SD~{O}) U401.12(SCK)
SPI1_nCS: TP404.1 U400.30(SCSDR~{V}/SDO) U401.14(~{CS})
SPI1_SIMO: TP408.1 U400.27(SDODRV/SCLK) U401.11(SDI)
SPI1_SOMI: TP410.1 U400.28(SDIDRV~{/}SCL~{K}) U401.10(SDO)
SRA: R403.2 TP415.1 U401.8(SRA)
SRB: R408.1 TP416.1 U401.17(SRB)
STEP: TP413.1 U400.24(STPOUT/PWMA/DACA) U401.31(STEP)
TARGET_REACHED: R405.2 U400.31(TARGET_REACHED) ; port TARGET_REACHED
NetC402_1: C402.1 U401.24(VHS)
NetC404_2: C404.2 L401.3 TP409.1 TP420.1 X1#1.1
NetC405_2: C405.2 L401.4 TP423.1 TP431.1 X1#1.2
NetC406_1: C406.1 Q402.S Q403.S R403.1 R404.2
NetC407_2: C407.2 L400.4 TP434.1 TP435.1 X1#1.3
NetC408_2: C408.2 L400.3 TP432.1 TP433.1 X1#1.4
NetC410_2: C410.2 TP436.1 U401.9(5V_OUT)
NetC412_2: C412.2 TP430.1 U400.35(VDD1V8_2)
NetC413_2: C413.2 TP429.1 U400.16(VDD1V8_1)
NetC417_2: C417.2 Q406.S Q407.S R408.2 R409.1
NetC418_2: C418.2 R411.1 TP438.1
NetC419_2: C419.2 R412.1 TP439.1
NetC420_2: C420.2 R413.1 TP440.1
NetD400_A: D400.A R405.1 TP426.1
NetD401_A: D401.A R406.1 TP427.1
NetD402_A: D402.A R407.1 TP428.1
NetR401_1: R401.1 U401.15(~{EN}) ; port nEN_TMC262
NetR410_1: R410.1 TP437.1 U400.7(SDOIN)

Not connected (* = marked no-connect by the designer): U400 1(~{A}/~{SCLK}/~{SCS_ENC})* 9(MP2)* 11(~{B}/~{SDI}/SDO_ENC)* 17(STEPIN)* 18(DIRIN)* 19(~{FREEZE})* 20(START)* 22(~{N})* 32(STDBY_CLK)*; U401 26(TST_ANA)*

### Buses and harness runs
bus Dig_In[1..3] = port Dig_In[1..3]
bus ENC1_[1..3] = port ENC1_[1..3]

### Notes on the sheet
- Motion Controller
- Gate Driver
- 16MHz Oscillator
- The Footprint PQFN-8_multi is design to be compatible with the following packages:
  ST / PowerFLAT 5x6
  Vishay / PowerPAK SO-8L
  ON Semi / Power 56
- (near R404) sense resistors
- (near C417) optional filter capacitors
- optional input protection resistors (10R to 47R)
- (near X1#1) Stepper Motor
- (near X1#1) Phase_B1
- (near X1#1) Phase_B2
- (near X1#1) Phase_A1
- Phase_B1
- 2 Phases bipolar Stepper Motor
- Rsense = 40mOhm
  Current can be adjusted by the CS parameter from 1 to 31. In addition to that, the current range can be divided in half and therfore the resolution can be doubled by setting the VSENSE parameter to 1.
  VSENSE =    1      /     0
  VFS (V)  = 0.165 / 0.305
- Current Scale
- Irms (A)
- Ipeak (A)
- Psense (W)
- (near X1#1) Phase_A2
- Phase_B2
- CS
- Phase_A1
- Phase_A2
- 15
- 31
- VSENSE = 1
- 1.94
- 2.83
- VSENSE = 0
- 5.22
- 3.59
- 2.75
- 4.00
- 7.39
- 5.08
- 0.15
- 0.32
- 1.09
- 0.52
- 1
- 0.18
- 0.33
- 0.25
- 0.46
- 0.001
- 0.004
- Project:
- ArtNo_Variant:
- Object:
- Creation Date:
- Modification Date:
- Created By:
- Modified By:
- DocNo:
- Index:
- Size, Template:
- A3, K_A3_V0006.SchDot
- Komax AG
  Industriestrasse 6
  CH-6036 Dierikon/LU
  Switzerland
- Print Date:
- File:
- Sheet
- of
- (in symbol C_EL_220UF/50V) +

### Library data of the parts
C400 C409 = C_EL_220UF/50V: EEVFK1H331Q; Manufacturer: Panasonic; Spannung: 50V; Strategic: 0; Bezeichnung: EEVFK1H331Q
C401 C404 C405 C407 C408 = CAP: Ceramic Capacitor >=50V X7R
  C401: FootprintBOM: 0402
C402 C403 C410-C416 C418-C420 = Cap: Ceramic Capacitor >=50V X7R
  C402 C410: FootprintBOM: 0603
  C403 C411-C416 C418-C420: FootprintBOM: 0402
C406 C417 = CAP: Ceramic Capacitor >=25V; FootprintBOM: 0603
D400-D402 = LED: as D301 on sheet 03_Power_Supply
L400 L401 = ACM1211-701-2PL-TL01: as L300 on sheet 03_Power_Supply; FootprintBOM: ACM90V
Q400 Q401 Q404 Q405 = MOSFET-P 1G,2x,3S,4D (Diode): P-Channel Power MOSFET, -60V; 3rdSource: FDMS86163P; MaxTemp: 175; MinTemp: -50; 2ndSourcesReleased: DMP6050SPS-13; Bemerkung: *; Distributor: *; FootprintBOM: *; Manufacturer: *; Notes: *; Reference: *; Strategic: *
Q402 Q403 Q406 Q407 = MOSFET-N 1G,4D,3S (Diode): N-Channel Power MOSFET, 60V; 3rdSource: FDMS86183; MaxTemp: 175; MinTemp: -50; 2ndSourcesReleased: DMT6016LPS-13
R401-R403 R405-R408 R410-R413 = RES2: Resistor 0.063W 1%; FootprintBOM: 0402
R404 R409 = RES2: Resistor 40m / 3W 1%; Manufacturer: Bourns; MaxTemp: 170; MinTemp: -55; 2ndSourcesReleased: YAG2173DKR-ND; FootprintBOM: 2512; Bemerkung: CRA2512-FZ-R040ELF; max. Verlustleistung: 3W
TP400-TP402 TP404-TP440 = P_PRUEFPAD: FootprintBOM: Testpoint
U400 = TMC4361A-LA: S-ramp motion controller for stepper motors with high velocities. With SPI and Step/Dir; QFN40(5x5); Manufacturer: TRINAMIC; Geometry.Height: 0.9mm; Datasheet: *; Distributor#1: *; Distributor#2: *; Ordercode - Distri#1: *; Ordercode - Distri#2: *; Ordercode - Manu#1: TMC4361A-LA; Value: TMC4361A-LA
U401 = TMC262-LA: Energy saving high resolution microstepping two phase stepper driver with Step/Dir, SPI, up to 60V, QFN32(5x5); Manufacturer: TRINAMIC; Geometry.Height: 0,9mm; Ordercode - Distri#1: 1460-1044-ND; Ordercode - Distri#2: 1858307; Datasheet: http://www.trinamic.com/_scripts/download.php?file=_articles%2Fproducts%2Fintegrated-circuits%2Ftmc262%2F_datasheet%2FTMC262_datasheet.pdf; Distributor#1: Digikey; Distributor#2: Farnell; Ordercode - Manu#1: TMC262-LA; Value: TMC262-LA
U402 = OSCILATOR4: MEMS Oscillator 16MHz 3,3V -40/+85°C; Manufacturer: ECS; FootprintBOM: SMD 2.5x2mm
X1#1 = CON_4P: MTA-156 Plug Connector 180° 4P 3.96mm

## Sheet 05_Encoder_IN.SchDoc: -
size A4; Date: -; ApprovedBy: -; CheckedBy: -; Author: -; CompanyName: -; DrawnBy: -; Engineer: -; Organization: Komax AG; Address1: -; Address2: -; Address3: -; Address4: -; DocumentNumber: -; Revision: -; SheetNumber: 5; SheetTotal: 8; KSDP_ObjectName: Encoder IN; KSDP_CreatedBy: Patrick Rossacher; KSDP_CreationDate: 18.12.2017; KSDP_ModificationDate: -; KSDP_ModifiedBy: -; CurrentTime: -; CurrentDate: -; Time: -; DocumentFullPathAndName: -; DocumentName: -; ModifiedDate: -; ImagePath: -
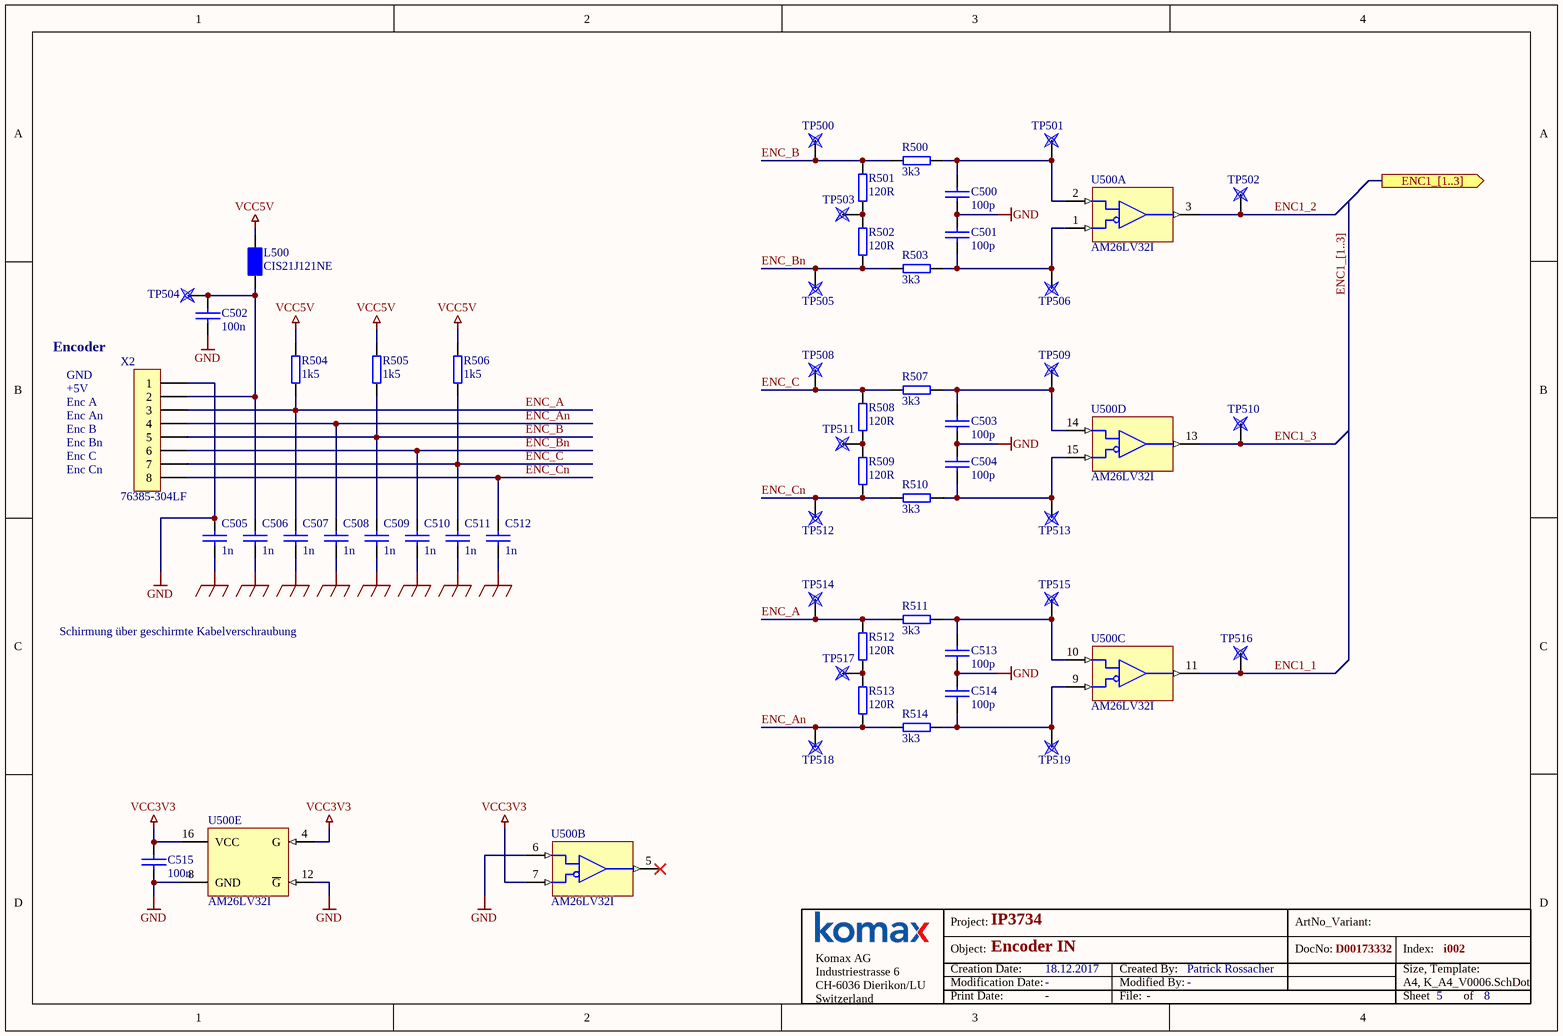
[diagram p4: 05_Encoder_IN.SchDoc]

### Parts
(Parts that share a designator on the sheet are numbered #1, #2 ... from top to bottom, then left to right.)
C500  100p  [0402_c]
C501  100p  [0402_c]
C502  100n  [0402_c]
C503  100p  [0402_c]
C504  100p  [0402_c]
C505  1n  [0402_c]
C506  1n  [0402_c]
C507  1n  [0402_c]
C508  1n  [0402_c]
C509  1n  [0402_c]
C510  1n  [0402_c]
C511  1n  [0402_c]
C512  1n  [0402_c]
C513  100p  [0402_c]
C514  100p  [0402_c]
C515  100n  [0402_c]
L500  CIS21J121NE  [0805_R]
R500  3k3  [0402_R]
R501  120R  [0603_R]
R502  120R  [0603_R]
R503  3k3  [0402_R]
R504  1k5  [0402_R]
R505  1k5  [0402_R]
R506  1k5  [0402_R]
R507  3k3  [0402_R]
R508  120R  [0603_R]
R509  120R  [0603_R]
R510  3k3  [0402_R]
R511  3k3  [0402_R]
R512  120R  [0603_R]
R513  120R  [0603_R]
R514  3k3  [0402_R]
TP500  TESTPUNKT  [TP1.5MM]  (value not drawn)  (no BOM)
TP501  TESTPUNKT  [TP1.5MM]  (value not drawn)  (no BOM)
TP502  TESTPUNKT  [TP1.5MM]  (value not drawn)  (no BOM)
TP503  TESTPUNKT  [TP1.5MM]  (value not drawn)  (no BOM)
TP504  TESTPUNKT  [TP1.5MM]  (value not drawn)  (no BOM)
TP505  TESTPUNKT  [TP1.5MM]  (value not drawn)  (no BOM)
TP506  TESTPUNKT  [TP1.5MM]  (value not drawn)  (no BOM)
TP508  TESTPUNKT  [TP1.5MM]  (value not drawn)  (no BOM)
TP509  TESTPUNKT  [TP1.5MM]  (value not drawn)  (no BOM)
TP510  TESTPUNKT  [TP1.5MM]  (value not drawn)  (no BOM)
TP511  TESTPUNKT  [TP1.5MM]  (value not drawn)  (no BOM)
TP512  TESTPUNKT  [TP1.5MM]  (value not drawn)  (no BOM)
TP513  TESTPUNKT  [TP1.5MM]  (value not drawn)  (no BOM)
TP514  TESTPUNKT  [TP1.5MM]  (value not drawn)  (no BOM)
TP515  TESTPUNKT  [TP1.5MM]  (value not drawn)  (no BOM)
TP516  TESTPUNKT  [TP1.5MM]  (value not drawn)  (no BOM)
TP517  TESTPUNKT  [TP1.5MM]  (value not drawn)  (no BOM)
TP518  TESTPUNKT  [TP1.5MM]  (value not drawn)  (no BOM)
TP519  TESTPUNKT  [TP1.5MM]  (value not drawn)  (no BOM)
U500  AM26LV32I  [SOIC-16]  (parts A,B,C,D,E of 5)
X2#1  76385-304LF  [CON_THT_FCI_76_385-304-LF]

### Ports
ENC1_[1..3] (out)

### Nets
GND: C500.2 C501.2 C502.1 C503.2 C504.2 C505.1 C513.2 C514.2 C515.2 U500.6(A2) U500.8(GND) U500.12(~{G}) X2#1.1
SHIELD_2: C505.2 C506.2 C507.2 C508.2 C509.2 C510.2 C511.2 C512.2
VCC3V3: C515.1 U500.4(G) U500.7(B2) U500.16(VCC)
VCC5V: L500.1 R504.1 R505.2 R506.2
ENC1_1: TP516.1 U500.11(Y3)
ENC1_2: TP502.1 U500.3(Y1)
ENC1_3: TP510.1 U500.13(Y4)
ENC_A: C507.1 R504.2 R511.2 R512.1 TP514.1 X2#1.3
ENC_An: C508.1 R513.2 R514.2 TP518.1 X2#1.4
ENC_B: C509.1 R500.2 R501.1 R505.1 TP500.1 X2#1.5
ENC_Bn: C510.1 R502.2 R503.2 TP505.1 X2#1.6
ENC_C: C511.1 R506.1 R507.2 R508.1 TP508.1 X2#1.7
ENC_Cn: C512.1 R509.2 R510.2 TP512.1 X2#1.8
NetC500_1: C500.1 R500.1 TP501.1 U500.2(A1)
NetC501_1: C501.1 R503.1 TP506.1 U500.1(B1)
NetC502_2: C502.2 C506.1 L500.2 TP504.1 X2#1.2
NetC503_1: C503.1 R507.1 TP509.1 U500.14(A4)
NetC504_1: C504.1 R510.1 TP513.1 U500.15(B4)
NetC513_1: C513.1 R511.1 TP515.1 U500.10(A3)
NetC514_1: C514.1 R514.1 TP519.1 U500.9(B3)
NetR501_2: R501.2 R502.1 TP503.1
NetR508_2: R508.2 R509.1 TP511.1
NetR512_2: R512.2 R513.1 TP517.1

Not connected (* = marked no-connect by the designer): U500 5(Y2)*

### Buses and harness runs
bus ENC1_[1..3] = port ENC1_[1..3]

### Notes on the sheet
- Encoder
- GND
- +5V
- Enc A
- Enc An
- Enc B
- Enc Bn
- Enc C
- Enc Cn
- Schirmung über geschirmte Kabelverschraubung
- Project:
- ArtNo_Variant:
- Object:
- Creation Date:
- Modification Date:
- Created By:
- Modified By:
- DocNo:
- Index:
- Size, Template:
- A4, K_A4_V0006.SchDot
- Komax AG
  Industriestrasse 6
  CH-6036 Dierikon/LU
  Switzerland
- Print Date:
- File:
- Sheet
- of

### Library data of the parts
C500-C515 = CAP: Ceramic Capacitor >=50V X7R; FootprintBOM: 0402
L500 = INDUCTOR1: Power Supression Bead 120Ohm bei 100MHz 5A; Manufacturer: Samsung; FootprintBOM: 0805
R500 R503-R507 R510 R511 R514 = RES2: Resistor 0.063W 1%; FootprintBOM: 0402
R501 R502 R508 R509 R512 R513 = RES2: Resistor 0.1W 1%; FootprintBOM: 0603
TP500-TP506 TP508-TP519 = P_PRUEFPAD: Testpoint; FootprintBOM: -
U500 = MAX3096CSE: 3.3V 4fach RS422 Receiver +-15kV ESD-Protected; Manufacturer: TI; 2ndSourcesReleased: ISL32173EFBZ; FootprintBOM: SOIC-16
X2#1 = CON8: Header 2x4p 180° RM=2.54mm; Manufacturer: Amphenol IIC; FootprintBOM: THT

## Sheet 06_Input_1-3.SchDoc: -
size A3; Date: -; ApprovedBy: -; CheckedBy: -; Author: -; CompanyName: -; DrawnBy: -; Engineer: -; Organization: Komax AG; Address1: -; Address2: -; Address3: -; Address4: -; DocumentNumber: -; Revision: -; SheetNumber: 6; SheetTotal: 8; KSDP_ObjectName: Input 1-3; KSDP_CreatedBy: Patrick Rossacher; KSDP_CreationDate: 18.12.2017; KSDP_ModificationDate: -; KSDP_ModifiedBy: -; CurrentTime: -; CurrentDate: -; Time: -; DocumentFullPathAndName: -; DocumentName: -; ModifiedDate: -; ImagePath: -
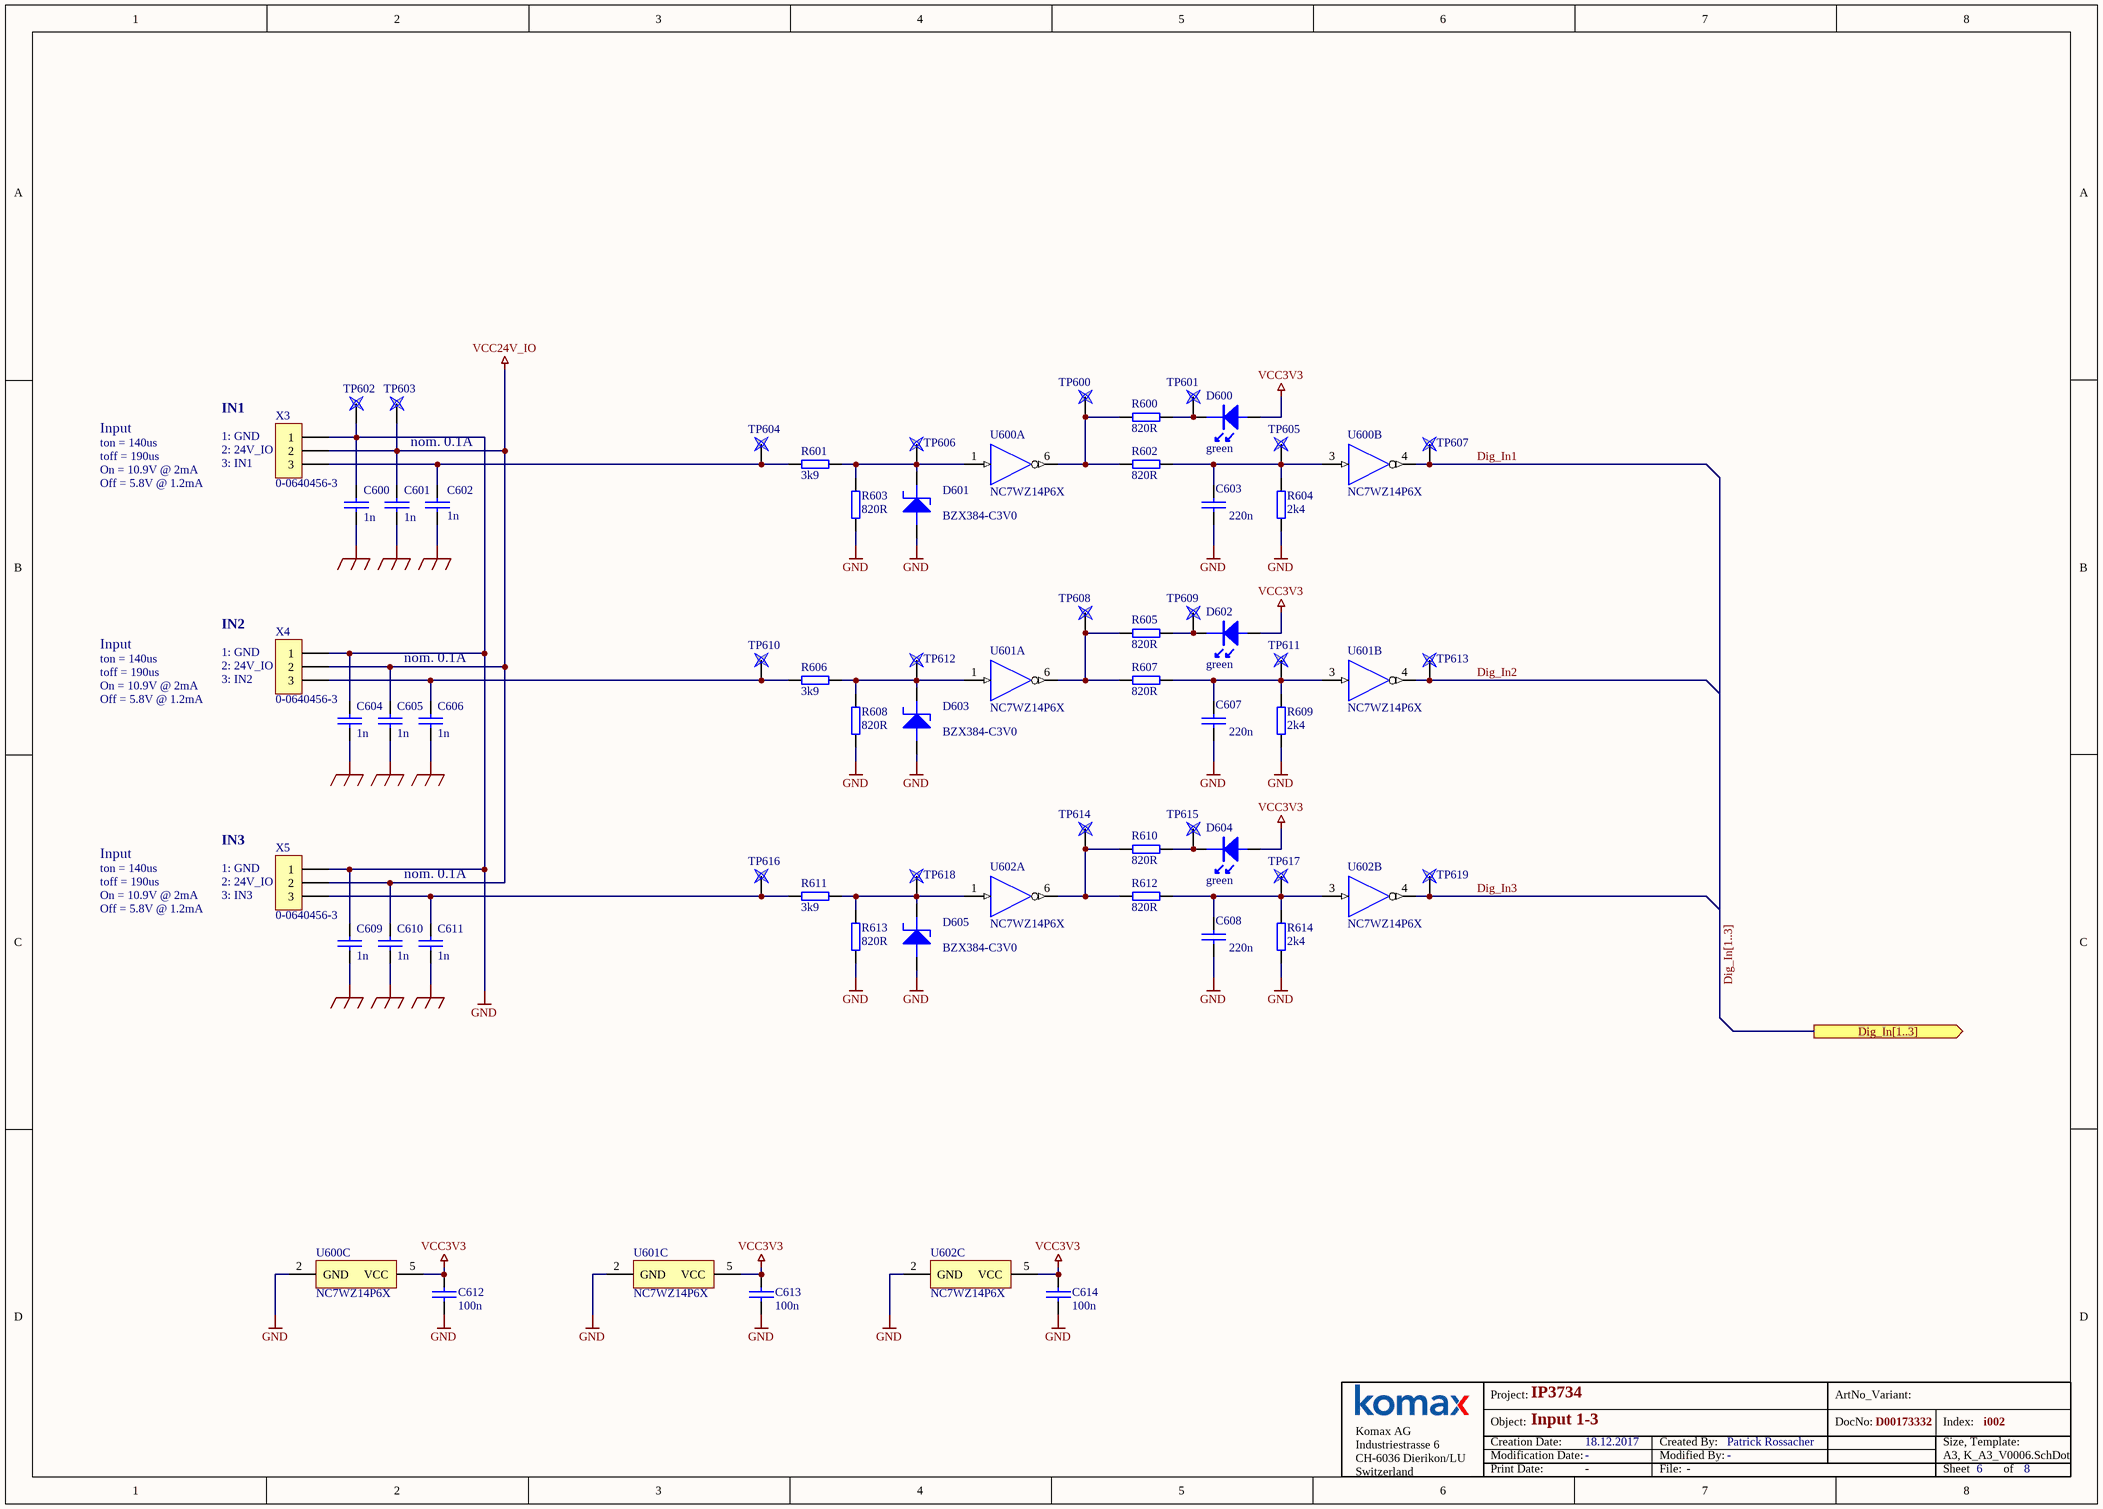
[diagram p5: 06_Input_1-3.SchDoc]

### Parts
(Parts that share a designator on the sheet are numbered #1, #2 ... from top to bottom, then left to right.)
C600  1n  [0402_c]
C601  1n  [0402_c]
C602  1n  [0402_c]
C603  220n  [0603_C]
C604  1n  [0402_c]
C605  1n  [0402_c]
C606  1n  [0402_c]
C607  220n  [0603_C]
C608  220n  [0603_C]
C609  1n  [0402_c]
C610  1n  [0402_c]
C611  1n  [0402_c]
C612  100n  [0402_C]
C613  100n  [0402_C]
C614  100n  [0402_C]
D600  color: green  [0603_led]  (hidden comment: HSMG-C190)
D601  BZX384-C3V0  [SOD-323]
D602  color: green  [0603_led]  (hidden comment: HSMG-C190)
D603  BZX384-C3V0  [SOD-323]
D604  color: green  [0603_led]  (hidden comment: HSMG-C190)
D605  BZX384-C3V0  [SOD-323]
R600  820R  [0402_R]
R601  3k9  [1206_R]
R602  820R  [0402_R]
R603  820R  [0402_R]
R604  2k4  [0402_R]
R605  820R  [0402_R]
R606  3k9  [1206_R]
R607  820R  [0402_R]
R608  820R  [0402_R]
R609  2k4  [0402_R]
R610  820R  [0402_R]
R611  3k9  [1206_R]
R612  820R  [0402_R]
R613  820R  [0402_R]
R614  2k4  [0402_R]
TP600  Testpoint  [TP1.5MM]  (value not drawn)  (no BOM)
TP601  Testpoint  [TP1.5MM]  (value not drawn)  (no BOM)
TP602  Testpoint  [TP1.5MM]  (value not drawn)  (no BOM)
TP603  Testpoint  [TP1.5MM]  (value not drawn)  (no BOM)
TP604  Testpoint  [TP1.5MM]  (value not drawn)  (no BOM)
TP605  Testpoint  [TP1.5MM]  (value not drawn)  (no BOM)
TP606  Testpoint  [TP1.5MM]  (value not drawn)  (no BOM)
TP607  Testpoint  [TP1.5MM]  (value not drawn)  (no BOM)
TP608  Testpoint  [TP1.5MM]  (value not drawn)  (no BOM)
TP609  Testpoint  [TP1.5MM]  (value not drawn)  (no BOM)
TP610  Testpoint  [TP1.5MM]  (value not drawn)  (no BOM)
TP611  Testpoint  [TP1.5MM]  (value not drawn)  (no BOM)
TP612  Testpoint  [TP1.5MM]  (value not drawn)  (no BOM)
TP613  Testpoint  [TP1.5MM]  (value not drawn)  (no BOM)
TP614  Testpoint  [TP1.5MM]  (value not drawn)  (no BOM)
TP615  Testpoint  [TP1.5MM]  (value not drawn)  (no BOM)
TP616  Testpoint  [TP1.5MM]  (value not drawn)  (no BOM)
TP617  Testpoint  [TP1.5MM]  (value not drawn)  (no BOM)
TP618  Testpoint  [TP1.5MM]  (value not drawn)  (no BOM)
TP619  Testpoint  [TP1.5MM]  (value not drawn)  (no BOM)
U600  NC7WZ14P6X  [SC70_6P]  (parts A,B,C of 3)
U601  NC7WZ14P6X  [SC70_6P]  (parts A,B,C of 3)
U602  NC7WZ14P6X  [SC70_6P]  (parts A,B,C of 3)
X3#1  0-0640456-3  [CON_THT_3P_MTA-100]
X4#1  0-0640456-3  [CON_THT_3P_MTA-100]
X5#1  0-0640456-3  [CON_THT_3P_MTA-100]

### Ports
Dig_In[1..3] (out)

### Nets
GND: C600.1 C603.2 C604.1 C607.2 C608.2 C609.1 C612.2 C613.2 C614.2 D601.A D603.A D605.A R603.1 R604.2 R608.1 R609.2 R613.1 R614.2 TP602.1 U600.2(GND) U601.2(GND) U602.2(GND) X3#1.1 X4#1.1 X5#1.1
SHIELD_2: C600.2 C601.2 C602.2 C604.2 C605.2 C606.1 C609.2 C610.1 C611.2
VCC3V3: C612.1 C613.1 C614.1 D600.A D602.A D604.A U600.5(VCC) U601.5(VCC) U602.5(VCC)
VCC24V_IO: C601.1 C605.1 C610.2 TP603.1 X3#1.2 X4#1.2 X5#1.2
Dig_In1: TP607.1 U600.4(Y)
Dig_In2: TP613.1 U601.4(Y)
Dig_In3: TP619.1 U602.4(Y)
NetC602_1: C602.1 R601.1 TP604.1 X3#1.3
NetC603_1: C603.1 R602.2 R604.1 TP605.1 U600.3(A)
NetC606_2: C606.2 R606.1 TP610.1 X4#1.3
NetC607_1: C607.1 R607.2 R609.1 TP611.1 U601.3(A)
NetC608_1: C608.1 R612.2 R614.1 TP617.1 U602.3(A)
NetC611_1: C611.1 R611.1 TP616.1 X5#1.3
NetD600_K: D600.K R600.1 TP601.1
NetD601_K: D601.K R601.2 R603.2 TP606.1 U600.1(A)
NetD602_K: D602.K R605.1 TP609.1
NetD603_K: D603.K R606.2 R608.2 TP612.1 U601.1(A)
NetD604_K: D604.K R610.1 TP615.1
NetD605_K: D605.K R611.2 R613.2 TP618.1 U602.1(A)
NetR600_2: R600.2 R602.1 TP600.1 U600.6(Y)
NetR605_2: R605.2 R607.1 TP608.1 U601.6(Y)
NetR610_2: R610.2 R612.1 TP614.1 U602.6(Y)

### Buses and harness runs
bus Dig_In[1..3] = port Dig_In[1..3]

### Notes on the sheet
- Input
- ton = 140us
- IN1
- (near X3#1) 1: GND
- (near X3#1) 2: 24V_IO
- nom. 0.1A
- toff = 190us
- On = 10.9V @ 2mA
- Off = 5.8V @ 1.2mA
- (near X3#1) 3: IN1
- IN2
- (near X4#1) 1: GND
- (near X4#1) 2: 24V_IO
- (near X4#1) 3: IN2
- IN3
- (near X5#1) 1: GND
- (near X5#1) 2: 24V_IO
- (near X5#1) 3: IN3
- Project:
- ArtNo_Variant:
- Object:
- Creation Date:
- Modification Date:
- Created By:
- Modified By:
- DocNo:
- Index:
- Size, Template:
- A3, K_A3_V0006.SchDot
- Komax AG
  Industriestrasse 6
  CH-6036 Dierikon/LU
  Switzerland
- Print Date:
- File:
- Sheet
- of

### Library data of the parts
C600-C614 = CAP: Ceramic Capacitor >=50V X7R
  C600-C602 C604-C606 C609-C614: FootprintBOM: 0402
  C603 C607 C608: FootprintBOM: 0603
D600 D602 D604 = LED: as D301 on sheet 03_Power_Supply
D601 D603 D605 = DIODEZENER: Zener Diode 3V; Manufacturer: NXP; MaxTemp: Tj +150; MinTemp: -55; FootprintBOM: SOD-323
R600 R602-R605 R607-R610 R612-R614 = RES2: Resistor 0.063W 1%; FootprintBOM: 0402
R601 R606 R611 = RES2: Resistor 0.25W 1%; FootprintBOM: 1206
TP600-TP619 = P_PRUEFPAD: FootprintBOM: Testpoint
U600-U602 = NC7WZ14P6X: Manufacturer: ON-Semi; MaxTemp: +85; MinTemp: -40; FootprintBOM: TSSOP-14
X3#1 X4#1 X5#1 = CON3: MTA-100 Plug Connector 180° 3p 2.54mm; Manufacturer: AMP/TYCO; MaxTemp: +105; MinTemp: -25; FootprintBOM: THT RM=2.54mm

## Sheet 07_Hardware_ID.SchDoc: -
size A4; Date: -; ApprovedBy: -; CheckedBy: -; Author: -; CompanyName: -; DrawnBy: -; Engineer: -; Organization: Komax AG; Address1: -; Address2: -; Address3: -; Address4: -; DocumentNumber: -; Revision: -; SheetNumber: 7; SheetTotal: 8; KSDP_ObjectName: Hardware ID; KSDP_CreatedBy: Patrick Rossacher; KSDP_CreationDate: 20.12.2017; KSDP_ModificationDate: -; KSDP_ModifiedBy: -; CurrentTime: -; CurrentDate: -; Time: -; DocumentFullPathAndName: -; DocumentName: -; ModifiedDate: -; ImagePath: -
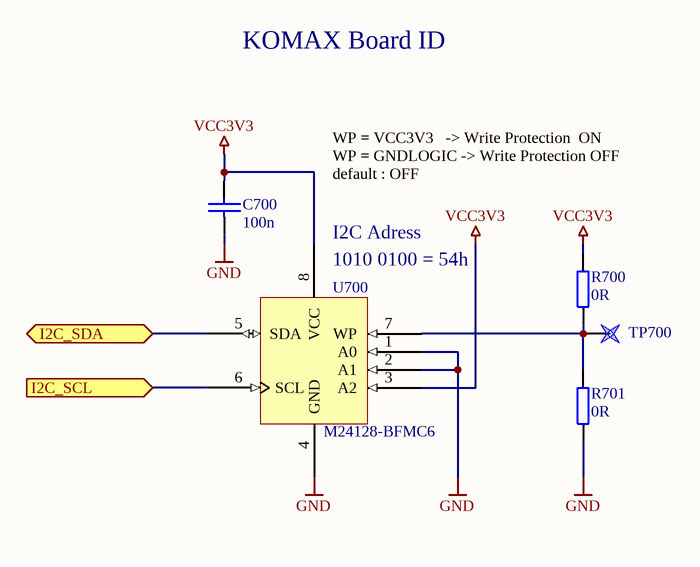
[diagram p6: 07_Hardware_ID.SchDoc]

### Parts
C700  100n  [0402_C]
R700  0R  [0402_R]
R701  0R  [0402_R]
TP700  Testpoint  [TP1.5MM]  (value not drawn)  (no BOM)
U700  M24128-BFMC6  [DFN-8-2x3]

### Ports
I2C_SCL (in), I2C_SDA (bidir)

### Nets
GND: C700.1 R701.1 U700.1(A0) U700.2(A1) U700.4(GND)
VCC3V3: C700.2 R700.2 U700.3(A2) U700.8(VCC)
I2C_SCL: U700.6(SCL) ; port I2C_SCL
I2C_SDA: U700.5(SDA) ; port I2C_SDA
NetR700_1: R700.1 R701.2 TP700.1 U700.7(WP)

### Notes on the sheet
- KOMAX Board ID
- WP = VCC3V3   -> Write Protection  ON
  WP = GNDLOGIC -> Write Protection OFF
  default : OFF
- (near U700) I2C Adress
- (near U700) 1010 0100 = 54h
- Project:
- ArtNo_Variant:
- Object:
- Creation Date:
- Modification Date:
- Created By:
- Modified By:
- DocNo:
- Index:
- Size, Template:
- A4, K_A4_V0006.SchDot
- Komax AG
  Industriestrasse 6
  CH-6036 Dierikon/LU
  Switzerland
- Print Date:
- File:
- Sheet
- of

### Library data of the parts
C700 = Cap: Ceramic Capacitor >=50V X7R; FootprintBOM: 0402
R700 R701 = RES2: Resistor 0.063W 1%; FootprintBOM: 0402
TP700 = P_PRUEFPAD: FootprintBOM: Testpoint
U700 = 24LC024: I2C Eeprom 128kBit; Manufacturer: ST Microelectronics; 2ndSourcesReleased: AT24C128C-MAHM-E; FootprintBOM: 8-UFDFN

## Sheet 08_PowerConcept.SchDoc: -
size A3; Date: -; ApprovedBy: -; CheckedBy: -; Author: -; CompanyName: -; DrawnBy: -; Engineer: -; Organization: Komax AG; Address1: -; Address2: -; Address3: -; Address4: -; DocumentNumber: -; Revision: -; SheetNumber: 8; SheetTotal: 8; KSDP_ObjectName: Power Concept; KSDP_CreatedBy: Patrick Rossacher; KSDP_CreationDate: 14.11.2018; KSDP_ModificationDate: -; KSDP_ModifiedBy: -; CurrentTime: -; CurrentDate: -; Time: -; DocumentFullPathAndName: -; DocumentName: -; ModifiedDate: -; ImagePath: -
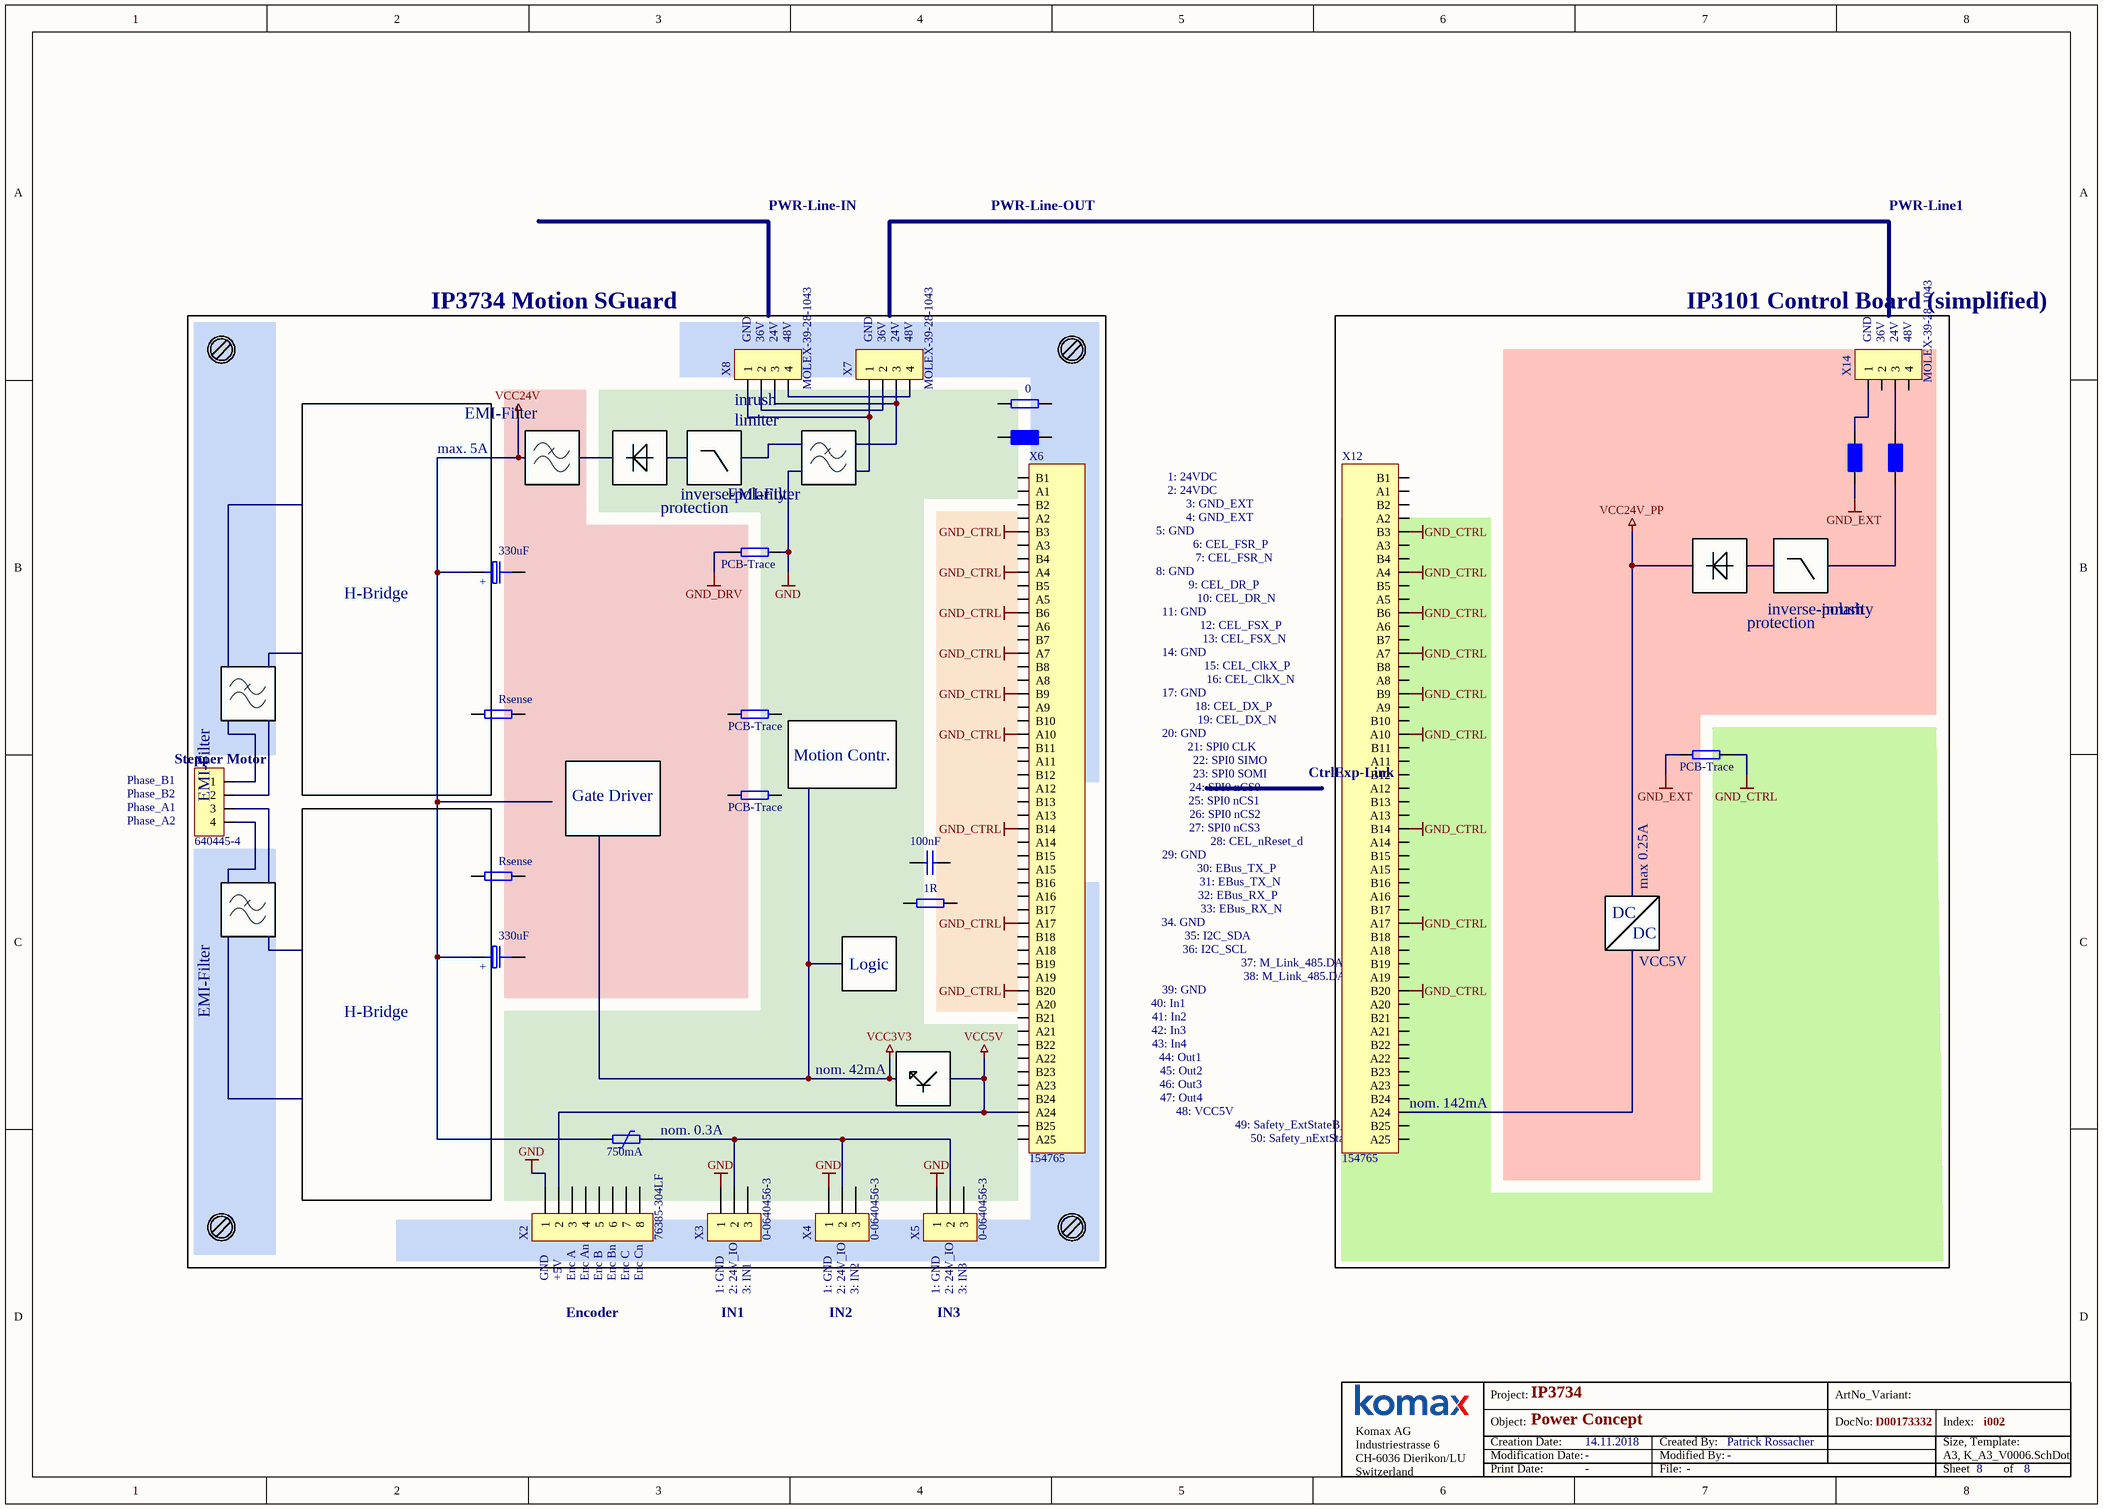
[diagram p7: 08_PowerConcept.SchDoc]

### Parts
(Parts that share a designator on the sheet are numbered #1, #2 ... from top to bottom, then left to right.)
C?#1  330uF  [SMD_Cap_Panasonic_H13]  (graphical)
C?#2  100nF  [0805_C]  (graphical)
C?#3  330uF  [SMD_Cap_Panasonic_H13]  (graphical)
F?  750mA  [1210_L]  (graphical)
L305  28F0181-1SR-10  [Laird 28F0181]  (value not drawn)  (graphical)
L308  28F0181-1SR-10  [Laird 28F0181]  (value not drawn)  (graphical)
L?  CIS21J121NE  [0805_R]  (value not drawn)  (graphical)
R?#1  0  [0805_R]  (graphical)
R?#2  PCB-Trace  [NET-CONNECT6]  (graphical)
R?#3  Rsense  [NET-CONNECT6]  (graphical)
R?#4  PCB-Trace  [NET-CONNECT6]  (graphical)
R?#5  PCB-Trace  [NET-CONNECT6]  (graphical)
R?#6  PCB-Trace  [NET-CONNECT6]  (graphical)
R?#7  Rsense  [NET-CONNECT6]  (graphical)
R?#8  1R  [0805_R]  (graphical)
X1#2  640445-4  [CON_THT_4P_MTA-156]  (graphical)
X2#2  76385-304LF  [CON_THT_FCI_76_385-304-LF]  (graphical)
X3#2  0-0640456-3  [CON_THT_3P_MTA-100]  (graphical)
X4#2  0-0640456-3  [CON_THT_3P_MTA-100]  (graphical)
X5#2  0-0640456-3  [CON_THT_3P_MTA-100]  (graphical)
X6#2  154765  [CON_SMD_50P_ERNI_154765]  (graphical)
X7#2  MOLEX-39-28-1043  [MOLEX-Minifit_4P_90_180deg]  (graphical)
X8#2  MOLEX-39-28-1043  [MOLEX-Minifit_4P_90_180deg]  (graphical)
X12  154765  [CON_SMD_50P_ERNI_154765]  (graphical)
X14  MOLEX-39-28-1043  [MOLEX-Minifit_4P_90_180deg]  (graphical)

### Blocks framed on the sheet
IP3734 Motion SGuard: C?#1-C?#3 F? L? R?#1-R?#4 R?#6-R?#8 X1#2 X2#2 X3#2 X4#2 X5#2 X6#2 X7#2 X8#2
IP3101 Control Board (simplified): L305 L308 R?#5 X14
nom. 142mA: X12

### Nets
GND: R?#2.1 X2#2.1 X3#2.1 X4#2.1 X5#2.1
GND_CTRL: R?#5.1 X6#2.A4 X6#2.A7 X6#2.A10 X6#2.A17 X6#2.B3 X6#2.B6 X6#2.B9 X6#2.B14 X6#2.B20 X12.A4 X12.A7 X12.A10 X12.A17 X12.B3 X12.B6 X12.B9 X12.B14 X12.B20
GND_DRV: R?#2.2
GND_EXT: L308.2 R?#5.2
VCC5V: X2#2.2 X6#2.A24
VCC24V: C?#1.1 C?#3.1 F?.1
NetF?_2: F?.2 X3#2.2 X4#2.2 X5#2.2
NetL305_1: L305.1 X14.3
NetL308_1: L308.1 X14.1
NetX7#2_1: X7#2.1 X8#2.1
NetX7#2_2: X7#2.2 X8#2.2
NetX7#2_3: X7#2.3 X8#2.3
NetX7#2_4: X7#2.4 X8#2.4

Not connected (* = marked no-connect by the designer): C?#1 2; C?#2 1 2; C?#3 2; L305 2; L? 1 2; R?#1 1 2; R?#3 1 2; R?#4 1 2; R?#6 1 2; R?#7 1 2; R?#8 1 2; X1#2 1 2 3 4; X2#2 3 4 5 6 7 8; X3#2 3; X4#2 3; X5#2 3; X6#2 A1 A2 A3 A5 A6 A8 A9 A11 A12 A13 A14 A15 A16 A18 A19 A20 A21 A22 A23 A25 B1 B2 B4 B5 B7 B8 B10 B11 B12 B13 B15 B16 B17 B18 B19 B21 B22 B23 B24 B25; X12 A1 A2 A3 A5 A6 A8 A9 A11 A12 A13 A14 A15 A16 A18 A19 A20 A21 A22 A23 A24 A25 B1 B2 B4 B5 B7 B8 B10 B11 B12 B13 B15 B16 B17 B18 B19 B21 B22 B23 B24 B25; X14 2 4

### Notes on the sheet
- PWR-Line-IN
- PWR-Line-OUT
- PWR-Line1
- (near X8#2) GND
- (near X8#2) 36V
- (near X8#2) 24V
- (near X8#2) 48V
- (near X7#2) GND
- (near X7#2) 36V
- (near X7#2) 24V
- (near X7#2) 48V
- (near X14) GND
- (near X14) 36V
- (near X14) 24V
- (near X14) 48V
- max. 5A
- EMI-Filter
- (near X8#2) inrush
- (near X8#2) limiter
- protection
- inverse-polarity
- 1: 24VDC
- 2: 24VDC
- 3: GND_EXT
- H-Bridge
- 5: GND
- 8: GND
- 4: GND_EXT
- 9: CEL_DR_P
- 6: CEL_FSR_P
- 7: CEL_FSR_N
- 11: GND
- 10: CEL_DR_N
- 12: CEL_FSX_P
- 13: CEL_FSX_N
- inrush
- 14: GND
- 17: GND
- 18: CEL_DX_P
- 19: CEL_DX_N
- 15: CEL_ClkX_P
- 16: CEL_ClkX_N
- (near X1#2) Phase_B1
- (near X1#2) Stepper Motor
- (near R?#6) Motion Contr.
- 20: GND
- 21: SPI0 CLK
- 22: SPI0 SIMO
- 23: SPI0 SOMI
- CtrlExp-Link
- (near X1#2) Phase_B2
- (near X1#2) Phase_A1
- (near X1#2) Phase_A2
- Gate Driver
- 29: GND
- 25: SPI0 nCS1
- 27: SPI0 nCS3
- 26: SPI0 nCS2
- 24: SPI0 nCS0
- 28: CEL_nReset_d
- Filter
- 30: EBus_TX_P
- 32: EBus_RX_P
- 31: EBus_TX_N
- 33: EBus_RX_N
- DC
- max 0.25A
- (near X1#2) EMI-Filter
- Logic
- 34. GND
- 39: GND
- 36: I2C_SCL
- 35: I2C_SDA
- 37: M_Link_485.DAT_P
- 38: M_Link_485.DAT_N
- VCC5V
- 40: In1
- 42: In3
- 41: In2
- 43: In4
- nom. 42mA
- 44: Out1
- 46: Out3
- 45: Out2
- 47: Out4
- 48: VCC5V
- 49: Safety_ExtStateB_d
- (near F?) nom. 0.3A
- 50: Safety_nExtStateFB_A
- (near X2#2) GND
- Encoder
- (near X2#2) +5V
- (near X2#2) Enc A
- (near X2#2) Enc An
- (near X2#2) Enc B
- (near X2#2) Enc Bn
- (near X2#2) Enc C
- (near X2#2) Enc Cn
- IN1
- (near X3#2) 1: GND
- (near X3#2) 2: 24V_IO
- (near X3#2) 3: IN1
- IN2
- (near X4#2) 1: GND
- (near X4#2) 2: 24V_IO
- (near X4#2) 3: IN2
- IN3
- (near X5#2) 1: GND
- (near X5#2) 2: 24V_IO
- (near X5#2) 3: IN3
- Project:
- ArtNo_Variant:
- Object:
- Creation Date:
- Modification Date:
- Created By:
- Modified By:
- DocNo:
- Index:
- Size, Template:
- A3, K_A3_V0006.SchDot
- Komax AG
  Industriestrasse 6
  CH-6036 Dierikon/LU
  Switzerland
- Print Date:
- File:
- Sheet
- of
- (in symbol C_EL_220UF/50V) +

### Library data of the parts
C?#1 C?#3 = C_EL_220UF/50V: as C400 on sheet 04_Driver; Bezeichnung: EEVFK1H331Q
C?#2 = Cap: Ceramic Capacitor >=50V X7R; FootprintBOM: 0805
F? = THERMAL FUSE_1: as F300 on sheet 03_Power_Supply; FootprintBOM: 1210
L305 L308 = INDUCTOR1: SMD Ferrit  115hm @ 100MHz 10A; Manufacturer: Laird; Distributor: Digikey; FootprintBOM: SMD
L? = INDUCTOR1: as L500 on sheet 05_Encoder_IN; FootprintBOM: 0805
R?#1 R?#8 = RES2: Resistor 0.125W 1%; FootprintBOM: 0805
R?#2-R?#7 = RES2: Circuit Path; FootprintBOM: -
X1#2 = CON_4P: MTA-156 Plug Connector 180° 4P 3.96mm
X2#2 = CON8: Header 2x4p 180° RM=2.54mm; Manufacturer: FCI Framatone; FootprintBOM: THT
X3#2 X4#2 X5#2 = CON3: as X3#1 on sheet 06_Input_1-3; FootprintBOM: THT RM=2.54mm
X6#2 X12 = CON_50P_ERNI: Connector SMC 2x25p 90° 1.27mm; Manufacturer: ERNI; Bemerkung: 13.65mm Bauhöhe; MaxTemp: 125; MinTemp: -55; 2ndSource: 15 15 050 5601 333 / Harting; 3rdSource: *; Distributor: *; FootprintBOM: SMD RM=1.27mm; Notes: *; Reference: *; Strategic: *
X7#2 X8#2 X14 = CON_4P: as X7#1 on sheet 03_Power_Supply; FootprintBOM: THT

## Nets that join several sheets
GND: 03_Power_Supply (18 pins), 04_Driver (19 pins), 05_Encoder_IN (13 pins), 06_Input_1-3 (25 pins), 07_Hardware_ID (5 pins), 08_PowerConcept (5 pins)
GND_CTRL: 02_CtrlExp_Link (9 pins), 03_Power_Supply (C311.1 R309.1 TP318.1), 08_PowerConcept (19 pins)
GND_DRV: 03_Power_Supply (6 pins), 04_Driver (14 pins), 08_PowerConcept (R?#2.2)
SHIELD_1: 01_D00173332_TopSheet (M103.1 TP100.1), 04_Driver (C407.1 C408.1)
SHIELD_2: 01_D00173332_TopSheet (M101.1 TP103.1), 05_Encoder_IN (8 pins), 06_Input_1-3 (9 pins)
SHIELD_3: 01_D00173332_TopSheet (M100.1 TP101.1), 03_Power_Supply (6 pins)
SHIELD_4: 01_D00173332_TopSheet (M102.1 TP102.1), 04_Driver (C404.1 C405.1)
VCC3V3: 03_Power_Supply (C310.1 R306.2 TP312.1 U300.5), 04_Driver (13 pins), 05_Encoder_IN (C515.1 U500.4 U500.7 U500.16), 06_Input_1-3 (9 pins), 07_Hardware_ID (C700.2 R700.2 U700.3 U700.8)
VCC5V: 02_CtrlExp_Link (X6#1.A24), 03_Power_Supply (5 pins), 05_Encoder_IN (L500.1 R504.1 R505.2 R506.2), 08_PowerConcept (X2#2.2 X6#2.A24)
VCC24V: 03_Power_Supply (6 pins), 04_Driver (9 pins), 08_PowerConcept (C?#1.1 C?#3.1 F?.1)
VCC24V_IO: 03_Power_Supply (F300.2), 06_Input_1-3 (7 pins)
Dig_In1: 02_CtrlExp_Link (R200.2), 04_Driver (U400.13), 06_Input_1-3 (TP607.1 U600.4)
Dig_In2: 02_CtrlExp_Link (R201.2), 04_Driver (U400.12), 06_Input_1-3 (TP613.1 U601.4)
Dig_In3: 04_Driver (U400.14), 06_Input_1-3 (TP619.1 U602.4)
ENC1_1: 04_Driver (U400.40), 05_Encoder_IN (TP516.1 U500.11)
ENC1_2: 04_Driver (U400.10), 05_Encoder_IN (TP502.1 U500.3)
ENC1_3: 04_Driver (U400.21), 05_Encoder_IN (TP510.1 U500.13)
I2C_SCL: 02_CtrlExp_Link (TP206.1 X6#1.A18), 07_Hardware_ID (U700.6)
I2C_SDA: 02_CtrlExp_Link (TP205.1 X6#1.B18), 07_Hardware_ID (U700.5)
INTR: 02_CtrlExp_Link (TP207.1 X6#1.A21), 04_Driver (R406.2 U400.33)
NetR401_1: 02_CtrlExp_Link (TP209.1 X6#1.A22), 04_Driver (R401.1 U401.15)
nRST: 02_CtrlExp_Link (TP204.1 X6#1.A14), 04_Driver (R402.1 U400.39)
SPI0_CLK: 02_CtrlExp_Link (TP200.1 X6#1.B11), 04_Driver (R412.2 U400.3)
SPI0_nCS0: 02_CtrlExp_Link (TP203.1 X6#1.A12), 04_Driver (R413.2 U400.2)
SPI0_SIMO: 02_CtrlExp_Link (TP201.1 X6#1.A11), 04_Driver (R411.2 U400.4)
SPI0_SOMI: 02_CtrlExp_Link (TP202.1 X6#1.B12), 04_Driver (R410.2)
TARGET_REACHED: 02_CtrlExp_Link (TP208.1 X6#1.B22), 04_Driver (R405.2 U400.31)

## Assembly variants
0384261: not fitted C406 C417 C500 C501 C502 C503 C504 C505 C506 C507 C508 C509 C510 C511 C512 C513 C514 C515 C600 C601 C602 C603 C604 C605 C606 C607 C608 C609 C610 C611 C612 C613 C614 D600 D601 D602 D603 D604 D605 F300 L500 R200 R201 R500 R501 R502 R503 R504 R505 R506 R507 R508 R509 R510 R511 R512 R513 R514 R600 R601 R602 R603 R604 R605 R606 R607 R608 R609 R610 R611 R612 R613 R614 R700 TP500 TP501 TP502 TP503 TP504 TP505 TP506 TP508 TP509 TP510 TP511 TP512 TP513 TP514 TP515 TP516 TP517 TP518 TP519 TP600 TP601 TP602 TP603 TP604 TP605 TP606 TP607 TP608 TP609 TP610 TP611 TP612 TP613 TP614 TP615 TP616 TP617 TP618 TP619 U500 U600 U601 U602 X2 X3 X4 X5
BETA: not fitted C406 C417 R700